# EasyEDA Pro project PRJ_Mainboard V0.1b.epro, board Mainboard_PCB
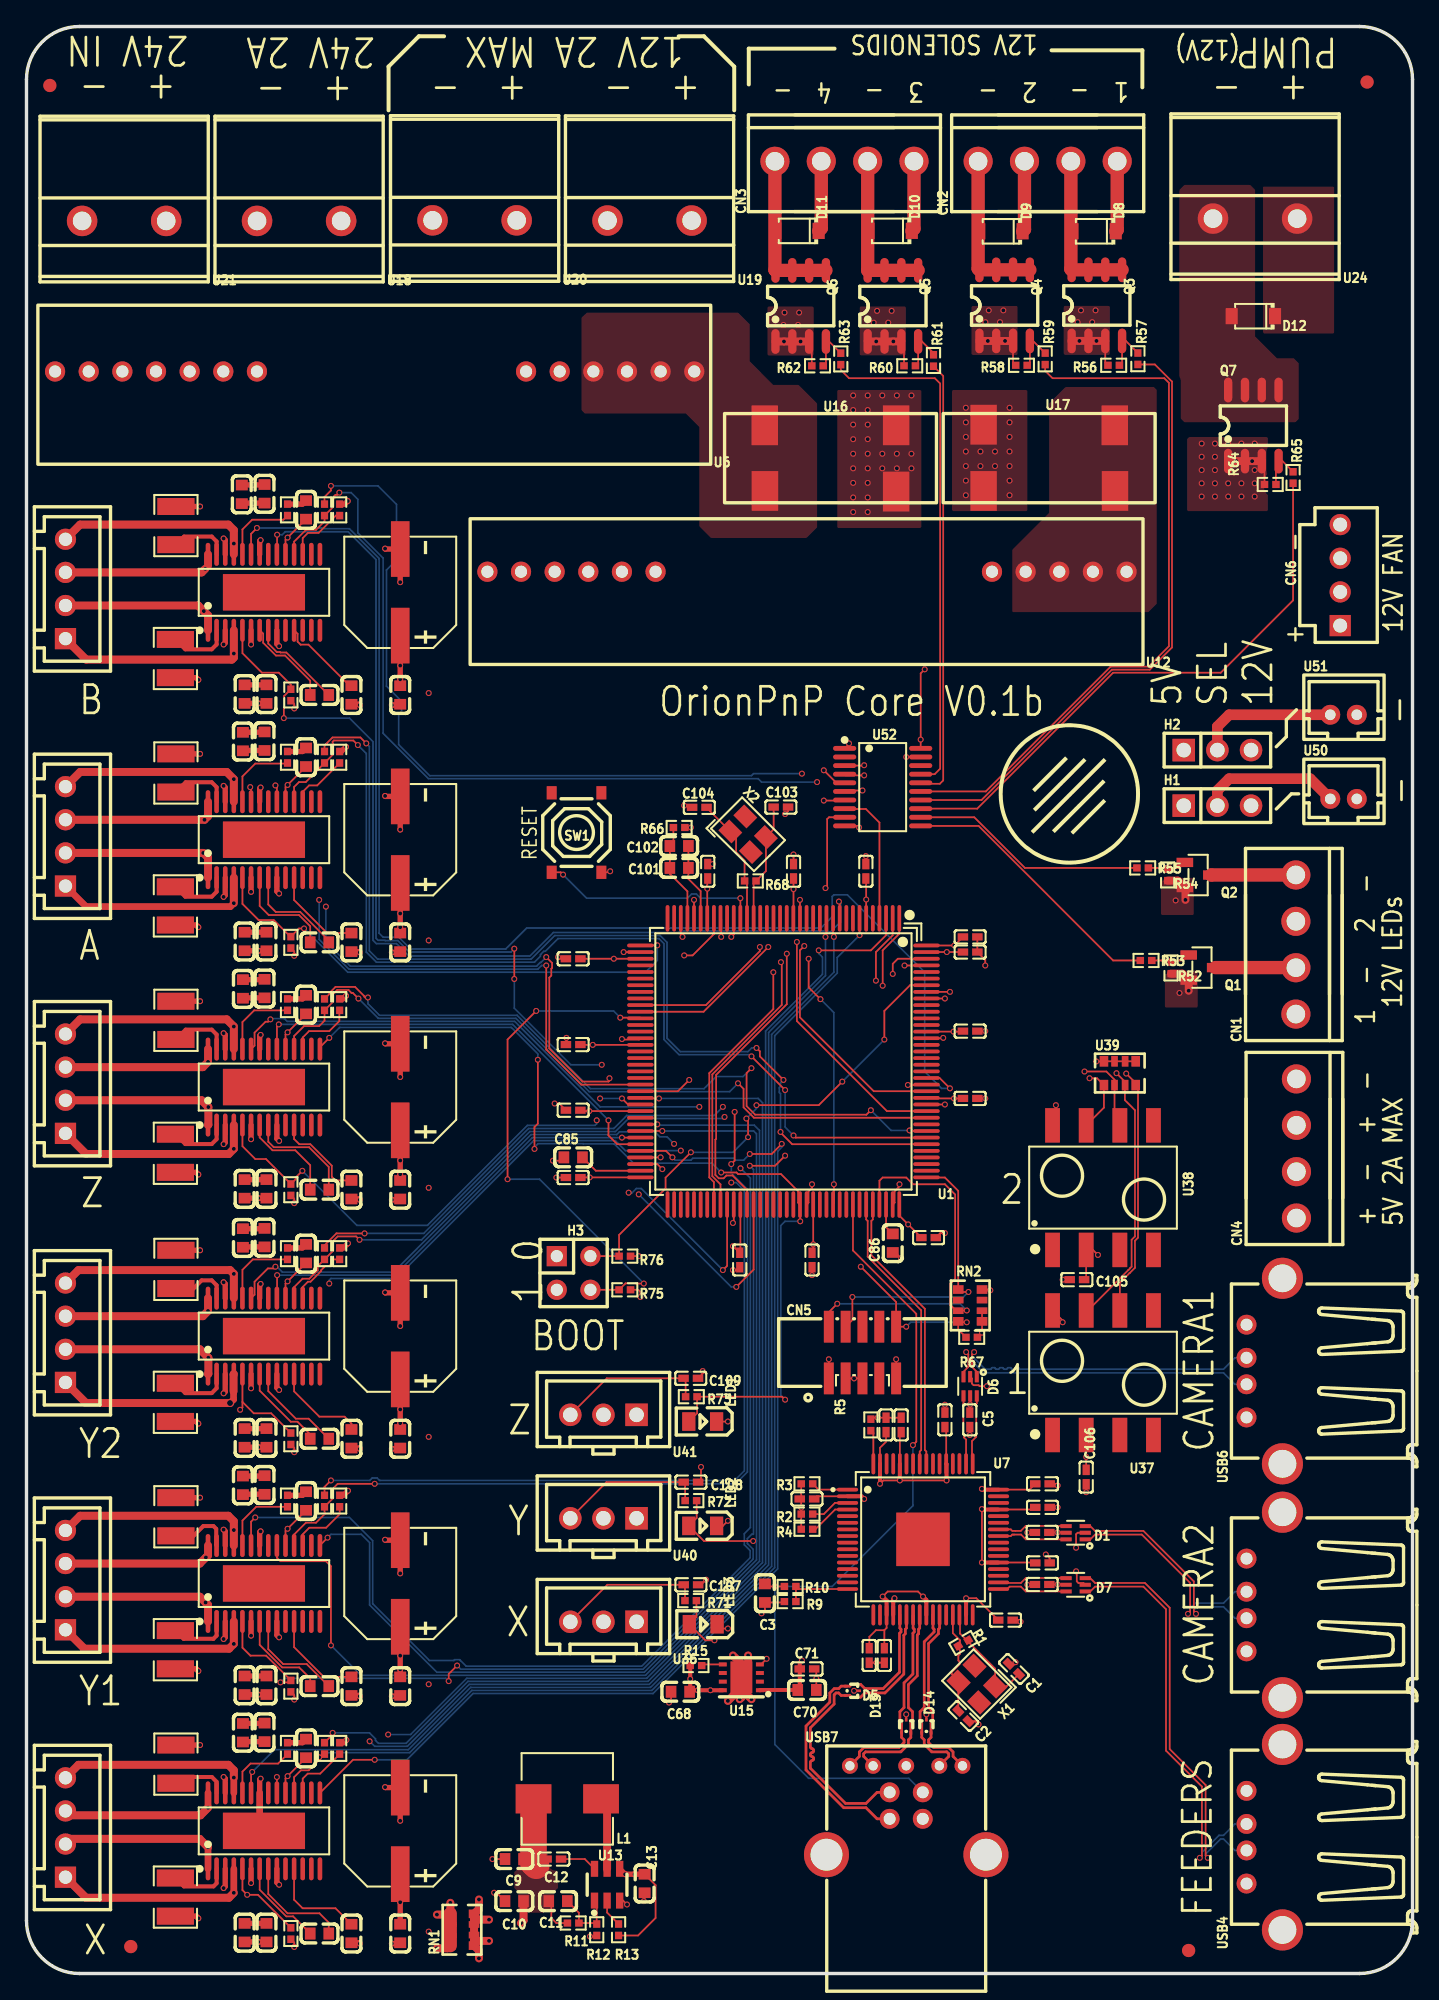
[diagram p6: board, top side]
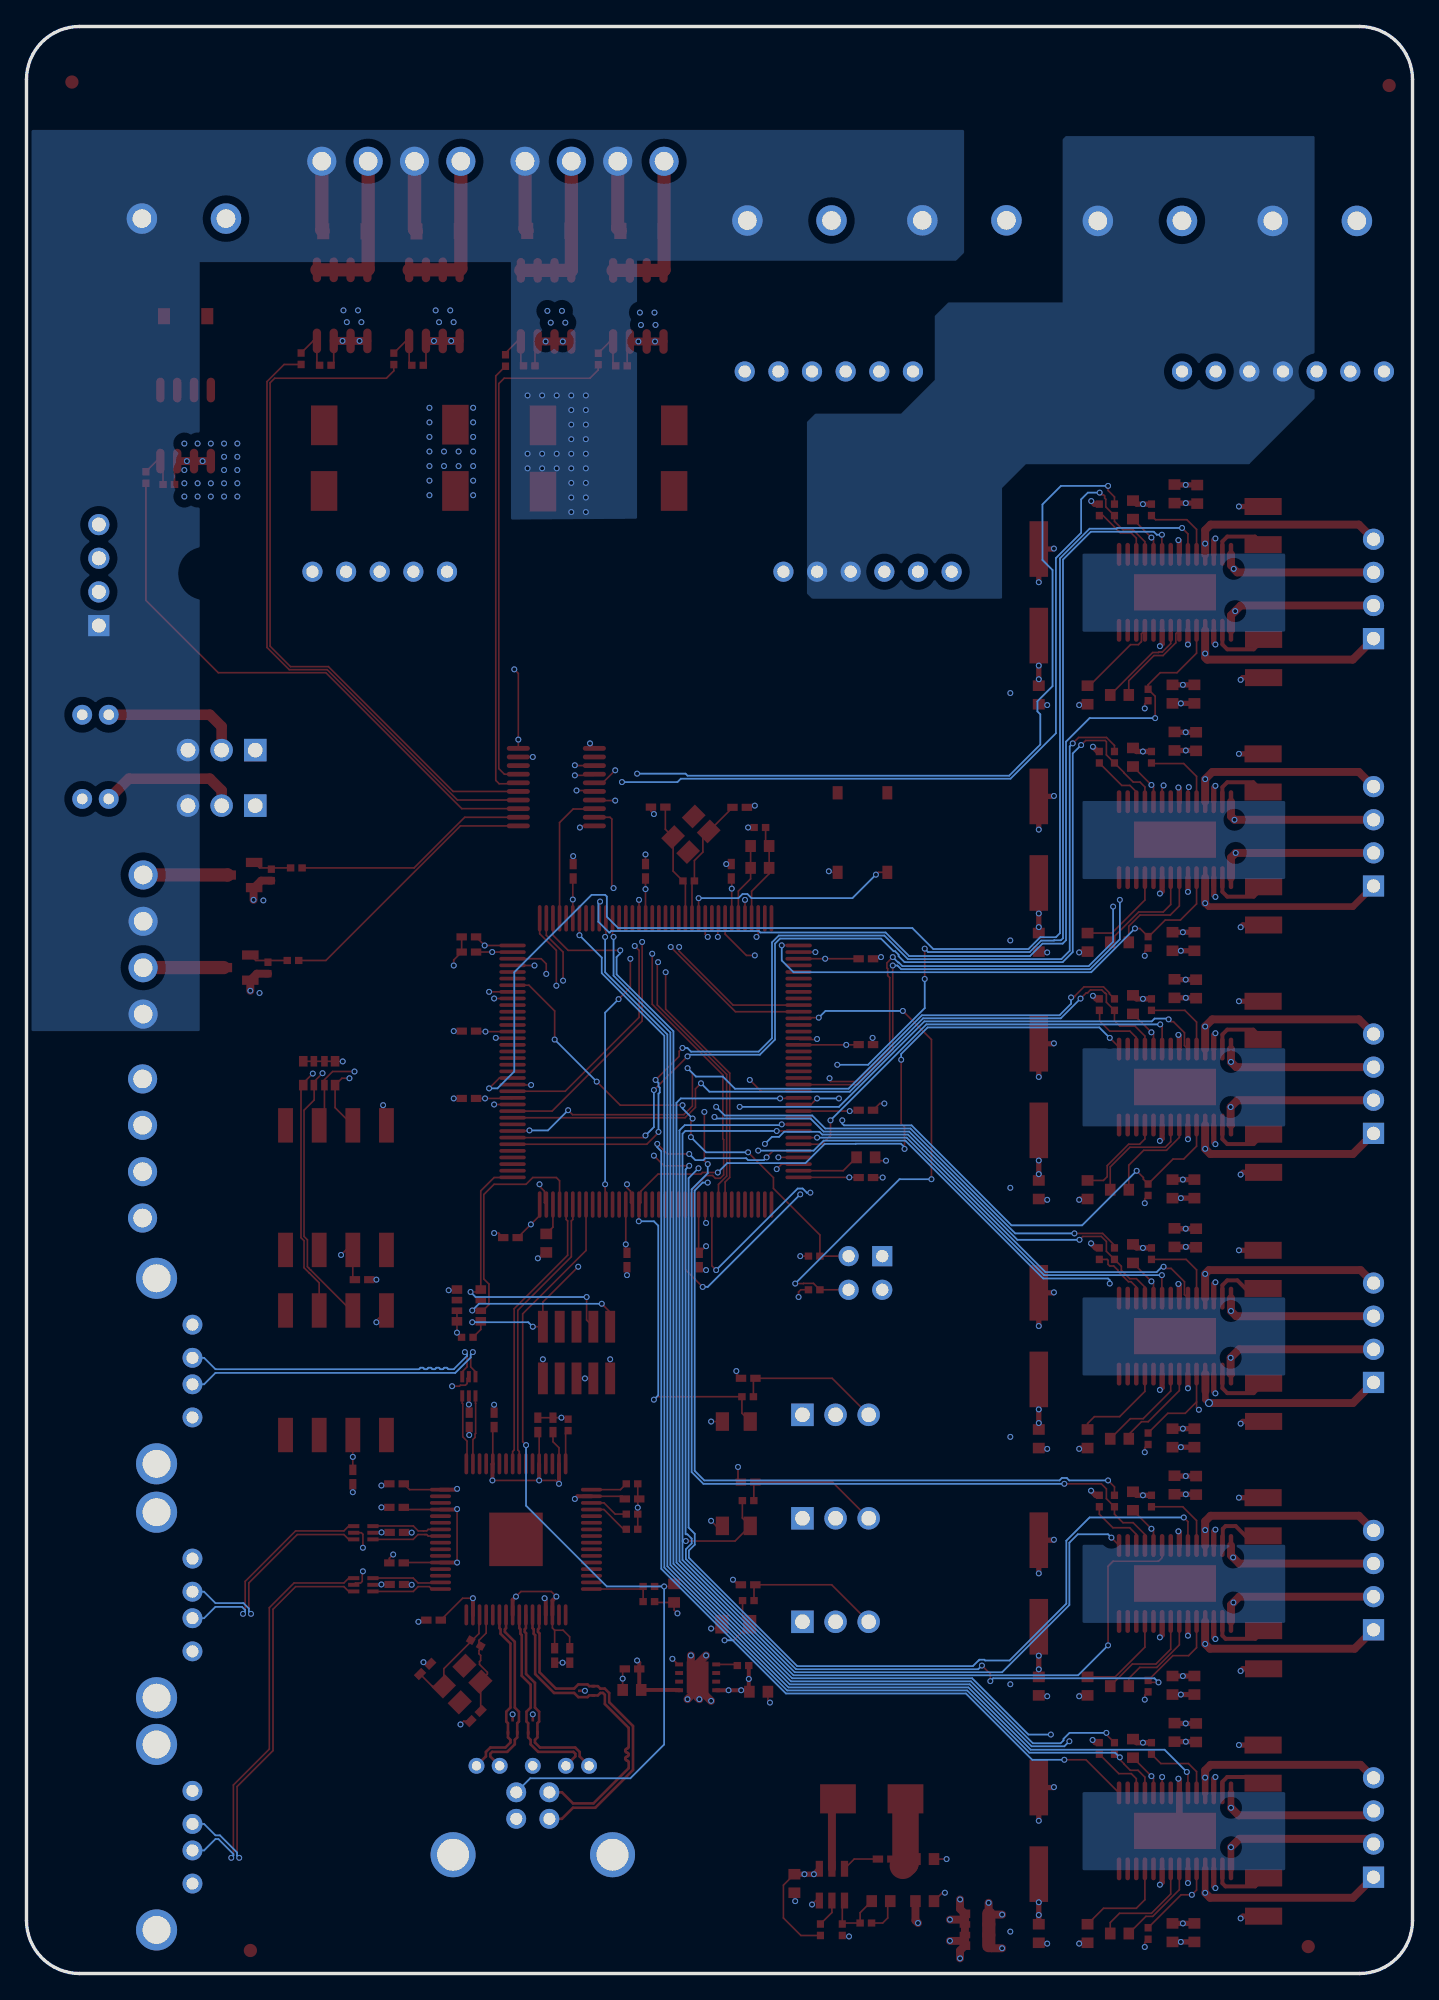
[diagram p7: board, bottom side, seen from below]

Outline 104.65 x 146.94 mm; copper layers: Top Layer, PWR, GND, Bottom Layer. Coordinates in mm from the lower left corner of the outline.
Outline path: 0,142.94 0,4 arc(1.17,1.17) 4,0 100.65,0 arc(103.48,1.17) 104.65,4 104.65,142.94 arc(103.48,145.77) 100.65,146.94 4,146.94 arc(1.17,145.77) 0,142.94
Stack: Top Layer 0.035mm Outer layer thickness 1oz / Dielectric1 0.2104mm 7628 RC49% 8.6mil / PWR 0.0152mm Inner layer thickness / Dielectric2 1.065mm 1.1mm H/HOZ Copper / GND 0.0152mm Inner layer thickness / Dielectric3 0.2104mm 7628 RC49% 8.6mil / Bottom Layer 0.035mm Outer layer thickness 1oz

## Design rules (mm)
net SSTX+: SSTX
net SSTX-: SSTX
net SSRX+: SSRX
net SSRX-: SSRX
net D1+: D1
net D1-: D1
net D2+: D2
net D2-: D2
net D3+: D3
net D3-: D3
net D4+: D4
net D4-: D4
net IN_D+: IN_D
net IN_D-: IN_D
net DCAM2-: DCAM2
net DCAM2+: DCAM2
net DCAM1-: DCAM1
net DCAM1+: DCAM1
net DSUB-: DSUB
net DSUB+: DSUB
net MOT1_B1: MOTOR
net MOT1_B2: MOTOR
net MOT1_A1: MOTOR
net MOT1_A2: MOTOR
net MOT2_B1: MOTOR
net MOT2_B2: MOTOR
net MOT2_A1: MOTOR
net MOT2_A2: MOTOR
net MOT3_B1: MOTOR
net MOT3_B2: MOTOR
net MOT3_A1: MOTOR
net MOT3_A2: MOTOR
net MOT4_B1: MOTOR
net MOT4_B2: MOTOR
net MOT4_A1: MOTOR
net MOT4_A2: MOTOR
net MOT5_B1: MOTOR
net MOT5_B2: MOTOR
net MOT5_A1: MOTOR
net MOT5_A2: MOTOR
net MOT6_B1: MOTOR
net MOT6_B2: MOTOR
net MOT6_A1: MOTOR
net MOT6_A2: MOTOR
template: Custom Config
spacing copperThickness1oz (default): track to track 0.102, other pairs 0.152 to 0.3
spacing copperThickness2oz: track to track 0.203, other pairs 0.152 to 0.3
track width copperThickness1oz (default): min 0.127, default 0.127, max 2.54
track width copperThickness2oz: min 0.203, default 0.254, max 2.54
track width MOTOR: min 0.127, default 0.5, max 2.54
track width 24V: min 0.127, default 0.4, max 2.54
differential pair USB_SS: width min 0.127, default 0.2, max 2.54; gap min 0.127, default 0.127
differential pair USB (default): width min 0.127, default 0.127, max 2.54; gap min 0.152, default 0.152
via viaSize (default): diameter min 0.4, default 0.45, max 10; hole min 0.3, default 0.3, max 6.3
via viaSize1: diameter min 0.45, default 0.45, max 10; hole min 0.3, default 0.3, max 6.3
via PWR: diameter min 0.4, default 0.6, max 10; hole min 0.3, default 0.45, max 6.3
net class MOTOR uses MOTOR, PWR
net 24V uses 24V, PWR
net SSTX+ uses USB_SS
net SSTX- uses USB_SS
net SSRX+ uses USB_SS
net SSRX- uses USB_SS
net IN_D+ uses USB_SS
net IN_D- uses USB_SS
net MOT1_B1 uses MOTOR, PWR
net MOT1_B2 uses MOTOR, PWR
net MOT1_A1 uses MOTOR, PWR
net MOT1_A2 uses MOTOR, PWR
net MOT2_B1 uses MOTOR, PWR
net MOT2_B2 uses MOTOR, PWR
net MOT2_A1 uses MOTOR, PWR
net MOT2_A2 uses MOTOR, PWR
net MOT3_B1 uses MOTOR, PWR
net MOT3_B2 uses MOTOR, PWR
net MOT3_A1 uses MOTOR, PWR
net MOT3_A2 uses MOTOR, PWR
net MOT4_B1 uses MOTOR, PWR
net MOT4_B2 uses MOTOR, PWR
net MOT4_A1 uses MOTOR, PWR
net MOT4_A2 uses MOTOR, PWR
net MOT5_B1 uses MOTOR, PWR
net MOT5_B2 uses MOTOR, PWR
net MOT5_A1 uses MOTOR, PWR
net MOT5_A2 uses MOTOR, PWR
net MOT6_B1 uses MOTOR, PWR
net MOT6_B2 uses MOTOR, PWR
net MOT6_A1 uses MOTOR, PWR
net MOT6_A2 uses MOTOR, PWR
diff pair SSTX uses USB_SS
diff pair SSRX uses USB_SS
diff pair IN_D uses USB_SS

## Placement (name value [footprint] x y rotation side)
C1  14pF  [C0402]  74.55 22.99 135 top
C2  14pF  [C0402]  70.74 19.43 315 top
C3  10uF  [C0603]  55.75 28.7 270 top
C4  100nF  [C0402]  76.68 33.29 180 top
C5  100nF  [C0402]  71.22 41.78 270 top
C8  100nF  [C0402]  76.68 29.36 180 top
C9  22u  [C0603]  36.83 8.64 180 top
C10  22u  [C0603]  36.83 5.46 180 top
C11  220p  [C0603]  40.13 5.46 0 top
C12  100nF  [C0402]  39.82 8.64 180 top
C13  10u  [C0603]  46.67 6.79 270 top
C14  22nF 50V  [C0603]  22.12 3.02 0 top
C15  100nF 50V  [C0603]  17.97 18.2 90 top
C16  100nF 50V  [C0603]  18.12 3.08 270 top
C17  100nF 50V  [C0603]  16.34 18.17 90 top
C18  100uF  [CAP-SMD_BD8.0-L8.3-W8.3-FD]  28.22 10.76 90 top
C19  100nF  [C0603]  21.11 16.99 90 top
C20  2u2 6.3V  [C0603]  24.53 3.02 270 top
C21  22nF 50V  [C0603]  22.12 21.69 0 top
C22  100nF 50V  [C0603]  17.97 36.87 90 top
C23  100nF 50V  [C0603]  18.12 21.75 270 top
C24  100nF 50V  [C0603]  16.34 36.84 90 top
C25  100uF  [CAP-SMD_BD8.0-L8.3-W8.3-FD]  28.22 29.43 90 top
C26  100nF  [C0603]  21.11 35.66 90 top
C27  2u2 6.3V  [C0603]  24.53 21.69 270 top
C28  22nF 50V  [C0603]  22.12 40.36 0 top
C29  100nF 50V  [C0603]  17.97 55.54 90 top
C30  100nF 50V  [C0603]  18.12 40.42 270 top
C31  100nF 50V  [C0603]  16.34 55.51 90 top
C32  100uF  [CAP-SMD_BD8.0-L8.3-W8.3-FD]  28.22 48.1 90 top
C33  100nF  [C0603]  21.11 54.33 90 top
C34  2u2 6.3V  [C0603]  24.53 40.36 270 top
C35  22nF 50V  [C0603]  22.12 59.15 0 top
C36  100nF 50V  [C0603]  17.97 74.33 90 top
C37  100nF 50V  [C0603]  18.12 59.22 270 top
C38  100nF 50V  [C0603]  16.34 74.31 90 top
C39  100uF  [CAP-SMD_BD8.0-L8.3-W8.3-FD]  28.22 66.9 90 top
C40  100nF  [C0603]  21.11 73.12 90 top
C41  2u2 6.3V  [C0603]  24.53 59.15 270 top
C42  22nF 50V  [C0603]  22.12 77.82 0 top
C43  100nF 50V  [C0603]  17.97 93 90 top
C44  100nF 50V  [C0603]  18.12 77.88 270 top
C45  100nF 50V  [C0603]  16.34 92.97 90 top
C46  100uF  [CAP-SMD_BD8.0-L8.3-W8.3-FD]  28.22 85.57 90 top
C47  100nF  [C0603]  21.11 91.79 90 top
C48  2u2 6.3V  [C0603]  24.53 77.82 270 top
C49  22nF 50V  [C0603]  22.12 96.49 0 top
C50  100nF 50V  [C0603]  16.26 111.63 90 top
C51  100nF 50V  [C0603]  18.12 96.55 270 top
C52  100nF 50V  [C0603]  17.97 111.67 90 top
C53  100uF  [CAP-SMD_BD8.0-L8.3-W8.3-FD]  28.22 104.24 90 top
C54  100nF  [C0603]  21.11 110.46 90 top
C55  2u2 6.3V  [C0603]  24.53 96.49 270 top
C56  4u7 35v  [C0603]  16.47 3.08 270 top
C57  4u7 35v  [C0603]  28.22 3.02 270 top
C58  4u7 35v  [C0603]  16.47 21.75 270 top
C59  4u7 35v  [C0603]  28.22 21.69 270 top
C60  4u7 35v  [C0603]  16.47 40.42 270 top
C61  4u7 35v  [C0603]  28.22 40.36 270 top
C62  4u7 35v  [C0603]  16.47 96.55 270 top
C63  4u7 35v  [C0603]  28.22 96.49 270 top
C64  4u7 35v  [C0603]  16.47 77.88 270 top
C65  4u7 35v  [C0603]  28.22 77.82 270 top
C66  4u7 35v  [C0603]  16.47 59.22 270 top
C67  4u7 35v  [C0603]  28.22 59.15 270 top
C68  22u  [C0603]  49.37 21.26 180 top
C70  10u  [C0603]  58.93 21.4 0 top
C71  100nF  [C0402]  58.93 22.99 0 top
C75  100nF  [C0402]  58.93 35.81 180 top
C76  100nF  [C0402]  73.91 26.67 0 top
C77  100nF  [C0402]  76.71 36.96 0 top
C78  100nF  [C0402]  66.04 41.4 90 top
C79  100nF  [C0402]  64.9 41.4 90 top
C80  100nF  [C0402]  64.77 24 270 top
C81  100nF  [C0402]  69.34 41.78 90 top
C82  100nF  [C0402]  63.63 24 270 top
C83  100nF  [C0402]  76.71 30.99 0 top
C84  100nF  [C0402]  76.71 35.18 0 top
C85  2u2 6.3V  [C0603]  41.28 61.59 0 top
C86  2u2 6.3V  [C0603]  65.41 55.12 90 top
C87  100nF  [C0402]  71.25 78.23 180 top
C88  100nF  [C0402]  71.25 77.09 180 top
C89  100nF  [C0402]  63.37 83.19 270 top
C90  100nF  [C0402]  41.28 65.15 0 top
C91  100nF  [C0402]  53.85 53.85 90 top
C92  100nF  [C0402]  59.31 53.85 90 top
C93  100nF  [C0402]  71.25 66.04 180 top
C94  100nF  [C0402]  57.91 83.19 270 top
C95  100nF  [C0402]  51.44 83.19 270 top
C96  100nF  [C0402]  41.28 76.58 0 top
C97  100nF  [C0402]  41.28 70.1 0 top
C98  100nF  [C0402]  41.28 60.07 0 top
C99  100nF  [C0402]  68.11 55.54 180 top
C100  100nF  [C0402]  71.25 71.12 180 top
C101  10u  [C0603]  49.28 83.44 180 top
C102  100nF  [C0603]  49.28 85.09 0 top
C103  14pF  [C0402]  56.96 88.03 0 top
C104  14pF  [C0402]  50.8 88.01 180 top
C105  100nF  [C0402]  79.31 52.36 180 top
C106  100nF  [C0402]  80.01 37.47 270 top
C107  100nF  [C0402]  50.16 29.34 180 top
C108  100nF  [C0402]  50.16 37.08 180 top
C109  100nF  [C0402]  50.16 44.92 180 top
CN1  1751264  [CONN-TH_MKDS1-4-3.5]  95.84 77.66 90 top
CN2  1751264  [CONN-TH_MKDS1-4-3.5]  77.1 136.77 180 top
CN3  1751264  [CONN-TH_MKDS1-4-3.5]  61.76 136.77 180 top
CN4  1751264  [CONN-TH_MKDS1-4-3.5]  95.88 62.26 90 top
CN5  20021521-00010T1LF  [IDC-SMD_10P-P1.27_X1270WVS-2X05B-6TV01]  63.12 46.86 0 top
CN6  2510-4A  [CONN-TH_4P-P2.54_CAX_2510-4A]  99.19 105.54 90 top
D1  USBLC6-2P6  [SOT-666-6_L1.6-W1.2-P0.50-LS1.6-BR]  79.21 33.26 0 top
D5  TPD2EUSB30DRTR  [SOT-9X3-3_L1.0-W0.8-P0.35-LS1.0-BR]  62.36 21.34 180 top
D6  USBLC6-2P6  [SOT-666-6_L1.6-W1.2-P0.50-LS1.6-BR]  71.25 44.31 90 top
D7  USBLC6-2P6  [SOT-666-6_L1.6-W1.2-P0.50-LS1.6-BR]  79.21 29.34 0 top
D8  1N5819HW-7-F  [SOD-123_L2.7-W1.6-LS3.7-RD]  80.61 131.49 180 top
D9  1N5819HW-7-F  [SOD-123_L2.7-W1.6-LS3.7-RD]  73.57 131.48 180 top
D10  1N5819HW-7-F  [SOD-123_L2.7-W1.6-LS3.7-RD]  65.21 131.52 180 top
D11  1N5819HW-7-F  [SOD-123_L2.7-W1.6-LS3.7-RD]  58.17 131.51 180 top
D12  1N5819HW-7-F  [SOD-123_L2.7-W1.6-LS3.7-RD]  92.63 125.08 180 top
D13  TPD2EUSB30DRTR  [SOT-9X3-3_L1.0-W0.8-P0.35-LS1.0-BR]  66.42 18.67 270 top
D14  TPD2EUSB30DRTR  [SOT-9X3-3_L1.0-W0.8-P0.35-LS1.0-BR]  67.94 18.67 270 top
H1  -  [HDR-TH_3P-P2.54-V-M]  89.92 88.14 0 top
H2  -  [HDR-TH_3P-P2.54-V-M]  89.92 92.33 0 top
H3  -  [HDR-TH_4P-P2.54-V-M-R2-C2-S2.54-1]  41.31 52.87 270 top
L1  3.3uH  [IND-SMD_L6.9-W6.9-LS7.0]  40.83 13.18 180 top
LED1  NCD0805R1  [LED0805-R-RD]  51.05 41.66 180 top
LED2  NCD0805R1  [LED0805-R-RD]  51.05 33.78 180 top
LED3  NCD0805R1  [LED0805-R-RD]  51.09 26.36 180 top
Q1  AO3400A  [SOT-23-3_L2.9-W1.3-P1.90-LS2.4-BR]  88.75 75.92 180 top
Q2  AO3400A  [SOT-23-3_L2.9-W1.3-P1.90-LS2.4-BR]  88.46 82.9 180 top
Q3  4406  [SOP-8_L4.9-W3.9-P1.27-LS6.0-BL]  80.81 125.89 0 top
Q4  4406  [SOP-8_L4.9-W3.9-P1.27-LS6.0-BL]  73.85 125.89 0 top
Q5  4406  [SOP-8_L4.9-W3.9-P1.27-LS6.0-BL]  65.42 125.85 0 top
Q6  4406  [SOP-8_L4.9-W3.9-P1.27-LS6.0-BL]  58.45 125.85 0 top
Q7  4406  [SOP-8_L4.9-W3.9-P1.27-LS6.0-BL]  92.63 116.82 0 top
R1  1M  [R0402]  70.73 24.94 210 top
R2  10K  [R0402]  58.93 34.67 0 top
R3  10K  [R0402]  58.93 36.96 0 top
R4  10K  [R0402]  58.93 33.53 0 top
R5  10K  [R0402]  63.75 41.4 270 top
R9  10K 1%  [R0402]  57.66 28.07 180 top
R10  90k9 1%  [R0402]  57.66 29.21 0 top
R11  100k  [R0402]  41.28 3.81 180 top
R12  22k1  [R0402]  43.05 3.3 90 top
R13  10k  [R0402]  44.7 3.3 270 top
R15  10k  [R0402]  50.55 23.24 0 top
R16  0R120 1W  [R1210]  11.28 15.8 90 top
R17  0R120 1W  [R1210]  11.24 5.77 90 top
R18  10k  [R0402]  23.65 16.99 90 top
R19  1k  [R0402]  22.5 16.99 90 top
R20  10k  [R0402]  19.96 3.02 270 top
R21  100k  [R0402]  19.71 16.99 90 top
R22  0R120 1W  [R1210]  11.28 34.47 90 top
R23  0R120 1W  [R1210]  11.24 24.44 90 top
R24  10k  [R0402]  23.65 35.66 90 top
R25  1k  [R0402]  22.5 35.66 90 top
R26  10k  [R0402]  19.96 21.69 270 top
R27  100k  [R0402]  19.71 35.66 90 top
R28  0R120 1W  [R1210]  11.28 53.14 90 top
R29  0R120 1W  [R1210]  11.24 43.11 90 top
R30  10k  [R0402]  23.65 54.33 90 top
R31  1k  [R0402]  22.5 54.33 90 top
R32  10k  [R0402]  19.96 40.36 270 top
R33  100k  [R0402]  19.71 54.33 90 top
R34  0R120 1W  [R1210]  11.28 71.94 90 top
R35  0R120 1W  [R1210]  11.24 61.9 90 top
R36  10k  [R0402]  23.65 73.12 90 top
R37  1k  [R0402]  22.5 73.12 90 top
R38  10k  [R0402]  19.96 59.15 270 top
R39  100k  [R0402]  19.71 73.12 90 top
R40  0R120 1W  [R1210]  11.28 90.6 90 top
R41  0R120 1W  [R1210]  11.24 80.57 90 top
R42  10k  [R0402]  23.65 91.79 90 top
R43  1k  [R0402]  22.5 91.79 90 top
R44  10k  [R0402]  19.96 77.82 270 top
R45  100k  [R0402]  19.71 91.79 90 top
R46  0R120 1W  [R1210]  11.28 109.27 90 top
R47  0R120 1W  [R1210]  11.24 99.24 90 top
R48  10k  [R0402]  23.65 110.46 90 top
R49  1k  [R0402]  22.5 110.46 90 top
R50  10k  [R0402]  19.96 96.49 270 top
R51  100k  [R0402]  19.71 110.46 90 top
R52  10K  [R0402]  86.42 75.89 90 top
R53  100  [R0402]  84.53 76.45 180 top
R54  10K  [R0402]  86.16 82.91 90 top
R55  100  [R0402]  84.27 83.44 180 top
R56  10K  [R0402]  82.09 121.37 0 top
R57  100  [R0402]  83.91 121.87 270 top
R58  10K  [R0402]  75.12 121.37 0 top
R59  100  [R0402]  76.91 121.86 270 top
R60  10K  [R0402]  66.69 121.33 0 top
R61  100  [R0402]  68.48 121.73 270 top
R62  10K  [R0402]  59.72 121.33 0 top
R63  100  [R0402]  61.48 121.85 270 top
R64  10K  [R0402]  93.9 112.38 0 top
R65  100  [R0402]  95.63 112.9 270 top
R66  10R  [R0402]  49.28 86.49 180 top
R67  10K  [R0402]  71.37 48.02 0 top
R68  1M  [R0402]  54.65 82.45 180 top
R71  1k  [R0402]  50.15 28.14 0 top
R72  1k  [R0402]  50.16 35.69 0 top
R73  1k  [R0402]  50.2 43.53 0 top
R75  1M  [R0402]  45.18 51.6 180 top
R76  1M  [R0402]  45.18 54.14 180 top
RN1  0Ω  [RES-ARRAY-SMD_0603-8P-L3.2-W1.6-BL]  32.89 3.3 90 top
RN2  10kΩ  [RES-ARRAY-SMD_0603-8P-L3.2-W1.6-BL]  71.25 50.42 270 top
SW1  TS-1187A-B-A-B  [SW-SMD_4P-L5.1-W5.1-P3.70-LS6.5-TL_H1.5]  41.53 86.11 90 top
U1  STM32F407ZGT6  [LQFP-144_L20.0-W20.0-P0.50-LS22.0-BL]  57.15 68.83 180 top
U2  TMC2226-SA-T  [HTSSOP-28_L9.8-W4.5-P0.65-LS6.6-BL-EP]  17.93 10.76 0 top
U6  NID100-12  [NID100-v PSU module]  50.42 120.9 180 top
U7  TUSB8041IPAPRQ1  [TQFP-64_L10.0-W10.0-P0.50-LS12.0-BL-EP]  67.69 32.77 270 top
U12  NID35-5  [NID35-v PSU module]  83.06 105.79 180 top
U13  SY8156IADC  [TSOT-23-6_L2.9-W1.6-P0.95-LS2.8-BL]  43.84 6.7 0 top
U15  TPS74611PQWDRBRQ1  [SON-8_L3.0-W3.0-P0.65-TL-EP]  53.97 22.35 180 top
U16  -  [XF-508PVS-B-B-R]  65.66 116.84 180 top
U17  -  [XF-508PVS-B-B-R]  72.26 111.89 0 top
U18  1714955  [CONN-TH_P6.35_1714955]  20.58 132.27 180 top
U19  1714955  [CONN-TH_P6.35_1714955]  47.04 132.3 180 top
U20  1714955  [CONN-TH_P6.35_1714955]  33.83 132.31 180 top
U21  1714955  [CONN-TH_P6.35_1714955]  7.37 132.27 180 top
U24  1714955  [CONN-TH_P6.35_1714955]  92.76 132.44 180 top
U25  TMC2226-SA-T  [HTSSOP-28_L9.8-W4.5-P0.65-LS6.6-BL-EP]  17.93 29.43 0 top
U26  TMC2226-SA-T  [HTSSOP-28_L9.8-W4.5-P0.65-LS6.6-BL-EP]  17.93 48.1 0 top
U27  TMC2226-SA-T  [HTSSOP-28_L9.8-W4.5-P0.65-LS6.6-BL-EP]  17.93 66.9 0 top
U28  TMC2226-SA-T  [HTSSOP-28_L9.8-W4.5-P0.65-LS6.6-BL-EP]  17.93 85.57 0 top
U29  TMC2226-SA-T  [HTSSOP-28_L9.8-W4.5-P0.65-LS6.6-BL-EP]  17.93 104.24 0 top
U30  B4B-XH-A-BK(LF)(SN)  [CONN-TH_B4B-XH-A-BK-LF-SN]  2.94 11.02 90 top
U31  B4B-XH-A-BK(LF)(SN)  [CONN-TH_B4B-XH-A-BK-LF-SN]  2.94 29.69 90 top
U32  B4B-XH-A-BK(LF)(SN)  [CONN-TH_B4B-XH-A-BK-LF-SN]  2.94 48.36 90 top
U33  B4B-XH-A-BK(LF)(SN)  [CONN-TH_B4B-XH-A-BK-LF-SN]  2.94 67.15 90 top
U34  B4B-XH-A-BK(LF)(SN)  [CONN-TH_B4B-XH-A-BK-LF-SN]  2.94 85.82 90 top
U35  B4B-XH-A-BK(LF)(SN)  [CONN-TH_B4B-XH-A-BK-LF-SN]  2.94 104.49 90 top
U36  XY-XHB2.54-3A11  [HDR-TH_3P-P2.50-V-F-2]  43.56 26.54 180 top
U37  GZP6897D2.5KPW  [SMD-8_L11.0-W7.0-P2.54-LS10.4-BL]  81.28 45.34 0 top
U38  GZP6897D2.5KPW  [SMD-8_L11.0-W7.0-P2.54-LS10.4-BL]  81.28 59.31 0 top
U39  4.7kΩ  [RES-ARRAY-SMD_0603-8P-L3.2-W1.6-BL]  82.55 67.94 0 top
U40  XY-XHB2.54-3A11  [HDR-TH_3P-P2.50-V-F-2]  43.56 34.35 180 top
U41  XY-XHB2.54-3A11  [HDR-TH_3P-P2.50-V-F-2]  43.56 42.16 180 top
U46  FIDUCIAL  [FIDUCIAL_1MM]  7.87 2.03 0 top
U47  FIDUCIAL  [FIDUCIAL_1MM]  87.74 1.74 0 top
U48  FIDUCIAL  [FIDUCIAL_1MM]  101.22 142.75 0 top
U49  FIDUCIAL  [FIDUCIAL_1MM]  1.76 142.49 0 top
U50  WAFER-PH2.0-2PZZ  [CONN-TH_2P-P2.00_HC-PH-2A-M]  99.44 88.65 0 top
U51  WAFER-PH2.0-2PZZ  [CONN-TH_2P-P2.00_HC-PH-2A-M]  99.44 95 0 top
U52  74HCT245PW,118  [TSSOP-20_L6.5-W4.4-P0.65-LS6.4-BL]  64.64 89.53 270 top
USB4  902-131A1011D10100  [USB-A-TH__USB-AF-90]  93.47 10.29 90 top
USB5  902-131A1011D10100  [USB-A-TH__USB-AF-90]  93.47 27.81 90 top
USB6  902-131A1011D10100  [USB-A-TH__USB-AF-90]  93.47 45.47 90 top
USB7  USB-306BWD-ARW  [USB-B-TH_XUNPU_USB-306BWD-ARW]  66.42 12.32 0 top
X1  24MHz  [CRYSTAL-SMD_4P-L3.2-W2.5-BL]  71.75 21.84 135 top
X2  8MHz  [CRYSTAL-SMD_4P-L3.2-W2.5-BL-2]  54.48 85.98 315 top

## Footprints (pads in the part's own frame, mm; a bottom-side part is the same pattern mirrored in y, then rotated)
C0402
  rect 0.79x0.54 smd: 1(-0.545,0) 2(0.545,0)
C0603
  rect 0.8x0.9 smd: 1(-0.7,0) 2(0.7,0)
CAP-SMD_BD8.0-L8.3-W8.3-FD
  rect 4.2x1.4 smd: 1(-3.267,0) 2(3.267,0)
CONN-TH_2P-P2.00_HC-PH-2A-M
  round 1.5 hole 0.8: 1(-1,0) 2(1,0)
CONN-TH_4P-P2.54_CAX_2510-4A
  rect 1.6x1.6 hole 1.05: 1(-3.81,0)
  round 1.6 hole 1.05: 2(-1.27,0) 3(1.27,0) 4(3.81,0)
CONN-TH_B4B-XH-A-BK-LF-SN
  rect 1.6x1.6 hole 1: 1(-3.75,0)
  round 1.6 hole 1: 2(-1.25,0) 3(1.25,0) 4(3.75,0)
CONN-TH_MKDS1-4-3.5
  round 2.2 hole 1.4: 1(-5.25,-0.002) 2(-1.75,-0.002) 3(1.75,-0.002) 4(5.25,0.002)
CONN-TH_P6.35_1714955
  round 2.3 hole 1.4: 1(-3.175,0) 2(3.175,0)
CRYSTAL-SMD_4P-L3.2-W2.5-BL
  rect 1.4x1.2 smd: 1(-1.1,-0.85) 2(1.1,-0.85) 3(1.1,0.85) 4(-1.1,0.85)
CRYSTAL-SMD_4P-L3.2-W2.5-BL-2
  rect 1.4x1.15 smd: 1(-1.1,-0.8) 2(1.1,-0.8) 3(1.1,0.8) 4(-1.1,0.8)
FIDUCIAL_1MM
  round 1 smd: 1(0,0)
HDR-TH_3P-P2.50-V-F-2
  rect 1.7x1.7 hole 1.1: 1(-2.5,0)
  round 1.7 hole 1.1: 2(0,0) 3(2.5,0)
HDR-TH_3P-P2.54-V-M
  rect 1.7x1.7 hole 1.1: 1(-2.54,0)
  round 1.7 hole 1.1: 2(0,0) 3(2.54,0)
HDR-TH_4P-P2.54-V-M-R2-C2-S2.54-1
  rect 1.524x1.524 hole 0.914: 1(-1.27,-1.27)
  round 1.524 hole 0.914: 2(-1.27,1.27) 3(1.27,-1.27) 4(1.27,1.27)
HTSSOP-28_L9.8-W4.5-P0.65-LS6.6-BL-EP
  oval 0.343x1.732 smd: 1(-4.225,-2.866) 2(-3.575,-2.866) 3(-2.925,-2.866) 4(-2.275,-2.866) 5(-1.625,-2.866) 6(-0.975,-2.866) 7(-0.325,-2.866) 8(0.325,-2.866) 9(0.975,-2.866) 10(1.625,-2.866) 11(2.275,-2.866) 12(2.925,-2.866) 13(3.575,-2.866) 14(4.225,-2.866) 15(4.225,2.866) 16(3.575,2.866) 17(2.925,2.866) 18(2.275,2.866) 19(1.625,2.866) 20(0.975,2.866) 21(0.325,2.866) 22(-0.325,2.866) 23(-0.975,2.866) 24(-1.625,2.866) 25(-2.275,2.866) 26(-2.925,2.866) 27(-3.575,2.866) 28(-4.225,2.866)
  rect 6.2x2.75 smd: 29(0,0)
IDC-SMD_10P-P1.27_X1270WVS-2X05B-6TV01
  rect 0.75x2.4 smd: 1(-2.54,-1.95) 2(-2.54,1.95) 3(-1.27,-1.95) 4(-1.27,1.95) 5(0,-1.95) 6(0,1.95) 7(1.27,-1.95) 8(1.27,1.95) 9(2.54,-1.95) 10(2.54,1.95)
IND-SMD_L6.9-W6.9-LS7.0
  rect 2.7x2.2 smd: 1(-2.55,0) 2(2.55,0)
LED0805-R-RD
  rect 1x1.399 smd: 1(1.05,0) 2(-1.05,0)
LQFP-144_L20.0-W20.0-P0.50-LS22.0-BL
  oval 0.28x2 smd: 1(-8.75,-10.8) 2(-8.25,-10.8) 3(-7.75,-10.8) 4(-7.25,-10.8) 5(-6.75,-10.8) 6(-6.25,-10.8) 7(-5.75,-10.8) 8(-5.25,-10.8) 9(-4.75,-10.8) 10(-4.25,-10.8) 11(-3.75,-10.8) 12(-3.25,-10.8) 13(-2.75,-10.8) 14(-2.25,-10.8) 15(-1.75,-10.8) 16(-1.25,-10.8) 17(-0.75,-10.8) 18(-0.25,-10.8) 19(0.25,-10.8) 20(0.75,-10.8) 21(1.25,-10.8) 22(1.75,-10.8) 23(2.25,-10.8) 24(2.75,-10.8) 25(3.25,-10.8) 26(3.75,-10.8) 27(4.25,-10.8) 28(4.75,-10.8) 29(5.25,-10.8) 30(5.75,-10.8) 31(6.25,-10.8) 32(6.75,-10.8) 33(7.25,-10.8) 34(7.75,-10.8) 35(8.25,-10.8) 36(8.75,-10.8) 73(8.75,10.8) 74(8.25,10.8) 75(7.75,10.8) 76(7.25,10.8) 77(6.75,10.8) 78(6.25,10.8) 79(5.75,10.8) 80(5.25,10.8) 81(4.75,10.8) 82(4.25,10.8) 83(3.75,10.8) 84(3.25,10.8) 85(2.75,10.8) 86(2.25,10.8) 87(1.75,10.8) 88(1.25,10.8) 89(0.75,10.8) 90(0.25,10.8) 91(-0.25,10.8) 92(-0.75,10.8) 93(-1.25,10.8) 94(-1.75,10.8) 95(-2.25,10.8) 96(-2.75,10.8) 97(-3.25,10.8) 98(-3.75,10.8) 99(-4.25,10.8) 100(-4.75,10.8) 101(-5.25,10.8) 102(-5.75,10.8) 103(-6.25,10.8) 104(-6.75,10.8) 105(-7.25,10.8) 106(-7.75,10.8) 107(-8.25,10.8) 108(-8.75,10.8)
  oval 2x0.28 smd: 37(10.8,-8.75) 38(10.8,-8.25) 39(10.8,-7.75) 40(10.8,-7.25) 41(10.8,-6.75) 42(10.8,-6.25) 43(10.8,-5.75) 44(10.8,-5.25) 45(10.8,-4.75) 46(10.8,-4.25) 47(10.8,-3.75) 48(10.8,-3.25) 49(10.8,-2.75) 50(10.8,-2.25) 51(10.8,-1.75) 52(10.8,-1.25) 53(10.8,-0.75) 54(10.8,-0.25) 55(10.8,0.25) 56(10.8,0.75) 57(10.8,1.25) 58(10.8,1.75) 59(10.8,2.25) 60(10.8,2.75) 61(10.8,3.25) 62(10.8,3.75) 63(10.8,4.25) 64(10.8,4.75) 65(10.8,5.25) 66(10.8,5.75) 67(10.8,6.25) 68(10.8,6.75) 69(10.8,7.25) 70(10.8,7.75) 71(10.8,8.25) 72(10.8,8.75) 109(-10.8,8.75) 110(-10.8,8.25) 111(-10.8,7.75) 112(-10.8,7.25) 113(-10.8,6.75) 114(-10.8,6.25) 115(-10.8,5.75) 116(-10.8,5.25) 117(-10.8,4.75) 118(-10.8,4.25) 119(-10.8,3.75) 120(-10.8,3.25) 121(-10.8,2.75) 122(-10.8,2.25) 123(-10.8,1.75) 124(-10.8,1.25) 125(-10.8,0.75) 126(-10.8,0.25) 127(-10.8,-0.25) 128(-10.8,-0.75) 129(-10.8,-1.25) 130(-10.8,-1.75) 131(-10.8,-2.25) 132(-10.8,-2.75) 133(-10.8,-3.25) 134(-10.8,-3.75) 135(-10.8,-4.25) 136(-10.8,-4.75) 137(-10.8,-5.25) 138(-10.8,-5.75) 139(-10.8,-6.25) 140(-10.8,-6.75) 141(-10.8,-7.25) 142(-10.8,-7.75) 143(-10.8,-8.25) 144(-10.8,-8.75)
NID35-v PSU module
  round 1.524 hole 0.914: 1(0,0) 2(2.54,0) 3(5.08,0) 4(7.62,0) 5(10.16,0) 6(35.56,0) 7(38.1,0) 8(40.64,0) 9(43.18,0) 10(45.72,0) 11(48.26,0)
NID100-v PSU module
  round 1.524 hole 0.914: 1(0,0) 2(2.54,0) 3(5.08,0) 4(7.62,0) 5(10.16,0) 6(12.7,0) 7(33.02,0) 8(35.56,0) 9(38.1,0) 10(40.64,0) 11(43.18,0) 12(45.72,0) 13(48.26,0)
R0402
  rect 0.566x0.54 smd: 1(-0.433,0) 2(0.433,0)
R1210
  rect 1.282x2.808 smd: 1(-1.441,0) 2(1.441,0)
RES-ARRAY-SMD_0603-8P-L3.2-W1.6-BL
  rect 0.65x0.8 smd: 1(-1.2,-0.9) 4(1.2,-0.9) 5(1.2,0.9) 8(-1.2,0.9)
  rect 0.5x0.8 smd: 2(-0.4,-0.9) 3(0.4,-0.9) 6(0.4,0.9) 7(-0.4,0.9)
SMD-8_L11.0-W7.0-P2.54-LS10.4-BL
  rect 1.12x2.6 smd: 1(-3.81,-4.7) 2(-1.27,-4.7) 3(1.27,-4.7) 4(3.81,-4.7) 5(3.81,4.7) 6(1.27,4.7) 7(-1.27,4.7) 8(-3.81,4.7)
SOD-123_L2.7-W1.6-LS3.7-RD
  rect 0.91x1.22 smd: 1(-1.635,0) 2(1.635,0)
SON-8_L3.0-W3.0-P0.65-TL-EP
  rect 0.6x0.3 smd: 1(-1.4,0.976) 2(-1.4,0.325) 3(-1.4,-0.325) 4(-1.4,-0.976) 5(1.4,-0.976) 6(1.4,-0.325) 7(1.4,0.325) 8(1.4,0.976)
  rect 1.65x2.4 smd: 9(0,0)
SOP-8_L4.9-W3.9-P1.27-LS6.0-BL
  oval 0.63x1.865 smd: 1(-1.905,-2.683) 2(-0.635,-2.683) 3(0.635,-2.683) 4(1.905,-2.683) 5(1.905,2.683) 6(0.635,2.683) 7(-0.635,2.683) 8(-1.905,2.683)
SOT-9X3-3_L1.0-W0.8-P0.35-LS1.0-BR
  rect 0.3x0.2 smd: 1(0.5,-0.35) 2(0.5,0.35) 3(-0.5,0)
SOT-23-3_L2.9-W1.3-P1.90-LS2.4-BR
  rect 1.25x0.7 smd: 1(1,-0.95) 2(1,0.95) 3(-1,0)
SOT-666-6_L1.6-W1.2-P0.50-LS1.6-BR
  rect 0.85x0.3 smd: 1(0.725,-0.5) 2(0.725,0) 3(0.725,0.5) 4(-0.725,0.5) 5(-0.725,0) 6(-0.725,-0.5)
SW-SMD_4P-L5.1-W5.1-P3.70-LS6.5-TL_H1.5
  rect 1x0.75 smd: 1(-3,1.875) 2(3,1.875) 3(-3,-1.875) 4(3,-1.875)
TQFP-64_L10.0-W10.0-P0.50-LS12.0-BL-EP
  oval 0.28x1.6 smd: 1(-3.75,-5.7) 2(-3.25,-5.7) 3(-2.75,-5.7) 4(-2.25,-5.7) 5(-1.75,-5.7) 6(-1.25,-5.7) 7(-0.75,-5.7) 8(-0.25,-5.7) 9(0.25,-5.7) 10(0.75,-5.7) 11(1.25,-5.7) 12(1.75,-5.7) 13(2.25,-5.7) 14(2.75,-5.7) 15(3.25,-5.7) 16(3.75,-5.7) 33(3.75,5.7) 34(3.25,5.7) 35(2.75,5.7) 36(2.25,5.7) 37(1.75,5.7) 38(1.25,5.7) 39(0.75,5.7) 40(0.25,5.7) 41(-0.25,5.7) 42(-0.75,5.7) 43(-1.25,5.7) 44(-1.75,5.7) 45(-2.25,5.7) 46(-2.75,5.7) 47(-3.25,5.7) 48(-3.75,5.7)
  oval 1.6x0.28 smd: 17(5.7,-3.75) 18(5.7,-3.25) 19(5.7,-2.75) 20(5.7,-2.25) 21(5.7,-1.75) 22(5.7,-1.25) 23(5.7,-0.75) 24(5.7,-0.25) 25(5.7,0.25) 26(5.7,0.75) 27(5.7,1.25) 28(5.7,1.75) 29(5.7,2.25) 30(5.7,2.75) 31(5.7,3.25) 32(5.7,3.75) 49(-5.7,3.75) 50(-5.7,3.25) 51(-5.7,2.75) 52(-5.7,2.25) 53(-5.7,1.75) 54(-5.7,1.25) 55(-5.7,0.75) 56(-5.7,0.25) 57(-5.7,-0.25) 58(-5.7,-0.75) 59(-5.7,-1.25) 60(-5.7,-1.75) 61(-5.7,-2.25) 62(-5.7,-2.75) 63(-5.7,-3.25) 64(-5.7,-3.75)
  rect 4.04x4.04 smd: 65(0,0)
TSOT-23-6_L2.9-W1.6-P0.95-LS2.8-BL
  rect 0.55x1.2 smd: 1(-0.95,-1.2) 2(0,-1.2) 3(0.95,-1.2) 4(0.95,1.2) 5(0,1.2) 6(-0.95,1.2)
TSSOP-20_L6.5-W4.4-P0.65-LS6.4-BL
  oval 0.364x1.742 smd: 1(-2.925,-2.871) 2(-2.275,-2.871) 3(-1.625,-2.871) 4(-0.975,-2.871) 5(-0.325,-2.871) 6(0.325,-2.871) 7(0.975,-2.871) 8(1.625,-2.871) 9(2.275,-2.871) 10(2.925,-2.871) 11(2.925,2.871) 12(2.275,2.871) 13(1.625,2.871) 14(0.975,2.871) 15(0.325,2.871) 16(-0.325,2.871) 17(-0.975,2.871) 18(-1.625,2.871) 19(-2.275,2.871) 20(-2.925,2.871)
USB-A-TH__USB-AF-90
  round 1.5 hole 0.9: 1(-3.5,1.355) 2(-1,1.355) 3(1,1.355) 4(3.5,1.355)
  round 3.1 hole 2.1: SH1(7,-1.355) SH2(-7,-1.355)
USB-B-TH_XUNPU_USB-306BWD-ARW
  round 1.5 hole 0.9: 1(1.25,1.355) 2(-1.25,1.355) 3(-1.25,-0.645) 4(1.25,-0.645)
  round 1.2 hole 0.7: 5(-4.25,3.355) 6(-2.5,3.355) 7(0,3.355) 8(2.5,3.355) 9(4.25,3.355)
  round 3.4 hole 2.4: 10(6.02,-3.355) 11(-6.02,-3.355)
XF-508PVS-B-B-R
  rect 2x3 smd: 1(0,5) 2(0,0) 3(9.92,0) 4(9.906,4.953)

## Nets
As in the schematic.

Pads without a net: CN5 7 8; CN6 2 3; RN2 2 7; SW1 2 4; U1 5 8 9 13 14 15 18 19 20 21 22 27 35 36 40 41 42 43 44 45 49 50 53 54 55 56 57 63 73 74 75 76 77 78 79 87 88 89 90 91 92 96 97 99 100 102 110 111 112 113 117 125 126 127 128 129 132 133 134 135 139 140; U2 10 12 13 14 16 21; U6 11 12 13; U7 5 6 7 8 9 10 11 12 13 14 15 17 18 28 32 35 36 38 39 40 43 44 46 47 51 52 54 55 58 59 61 62; U12 9 10 11; U15 2 3 6 7; U25 10 12 13 14 16 21; U26 10 12 13 14 16 21; U27 10 12 13 14 16 21; U28 10 12 13 14 16 21; U29 10 12 13 14 16 21; U37 1 3 4 5; U38 1 3 4 5; U46 1; U47 1; U48 1; U49 1; U52 2 18; USB4 SH1 SH2; USB5 SH1 SH2; USB6 SH1 SH2; X1 2 4; X2 2 4

## Via types
v1: diameter 0.45, hole 0.3, Top Layer to Bottom Layer, 537 vias
v2: diameter 0.6, hole 0.45, Top Layer to Bottom Layer, 1 via

## Routing (per net, layer and track width the routed paths; a pad name or vN(x,y) marks a point on that pad's centre or on a via; arc(x,y) is an arc through that point)
1V1: length 62.7
  Top Layer w0.127: U7.53 69.44,41.14 C81.1 ; U7.45 76,35.02 C84.1 ; v1(64.44,36.96) 64.69,37.21 v1(65.94,37.21) v1(69.47,37.21) ; U7.60 65.94,40.76 C78.1 ; U7.37 76.13,31.02 C83.1 ; v1(72.14,35.05) v1(72.14,31.02) ; v1(64.64,28.45) 65.02,28.83 67.31,28.83 v1(67.69,28.45) ; U7.63 64.44,39.68 64.9,40.13 C79.1 ; 63.64,24.6 63.64,25.41 64.13,25.91 64.77,25.91 ; C80.1 64.77,25.91 ; 64.77,25.91 64.94,26.08 U7.19
  Top Layer w0.3: v1(58.55,23.62) 58.38,23.46 C71.1 58.38,21.55 C70.1 55.4,21.4 U15.1 ; v1(69.47,37.21) 69.47,38.44 U7.53 ; U7.37 v1(72.14,31.02) ; U7.25 67.94,28.2 v1(67.69,28.45) ; v1(64.64,28.45) 64.94,28.15 U7.19 ; v1(72.14,35.05) 72.17,35.02 U7.45 ; U7.60 v1(65.94,37.21) ; U7.63 v1(64.44,36.96)
  PWR w0.127: v1(72.14,31.02) 70.26,31.02 v1(67.69,28.45) ; v1(64.64,28.45) 59.82,23.62 v1(58.55,23.62) ; v1(72.14,35.05) 71.63,35.05 v1(69.47,37.21)
3V3: length 265.7
  Top Layer w0.127: U25.19 19.56,33.41 21.11,34.96 ; U1.32 v1(50.4,81.03) ; C106.1 v1(80.01,38.99) U37.2 ; U1.72 v1(42.52,60.08) 41.83,60.08 C98.2 ; U1.121 67.99,66.04 v1(70.03,66.04) C93.2 ; C75.1 59.68,36.02 U7.2 ; C33.1 19.56,52.08 19.56,50.97 ; U1.52 v1(42.76,70.08) 41.84,70.08 C97.2 ; C11.1 39.62,5.27 39.62,4.19 40,3.81 R11.2 ; C95.2 51.4,82.61 v1(51.4,81.87) U1.30 ; v1(80.77,68.83) 81.34,68.83 U39.8 U39.7 U39.6 U39.5 ; U1.17 57.91,79.65 v1(57.91,81.84) C94.2 ; U1.131 v1(70,71.08) 70.67,71.08 C100.2 ; R38.2 20.22,58.47 v1(20.22,58.14) ; v1(20.22,95.47) 20.22,95.8 R50.2 ; v1(80.9,54.23) 80.52,54.61 U38.2 80.01,52.52 C105.1 ; U1.144 v1(70.05,77.58) C87.2 ; C47.1 19.56,89.54 U28.19 ; C90.2 41.89,65.08 v1(42.49,65.08) U1.62 ; R67.2 v1(72.15,48.37) RN2.5 RN2.6 ; v1(20.22,39.34) 20.22,39.67 R32.2 ; C96.2 41.82,76.58 v1(44.35,76.58) U1.39 ; C99.2 v1(66.57,56.53) 65.9,57.2 U1.108 ; C89.2 63.4,82.61 v1(63.4,81.05) U1.6 ; v1(20.22,20.67) 20.22,21 R26.2 ; CN5.1 v1(60.58,46.35) ; v1(20.22,76.81) 20.22,77.13 R44.2 ; C54.1 19.56,108.21 19.56,107.1 ; C19.1 19.56,14.74 19.56,13.63 ; U7.48 75.72,36.52 C77.1 ; U1.84 53.9,54.44 C91.2 53.35,54.89 v1(53.34,54.89) ; C40.1 19.56,70.87 U27.19 ; C88.2 v1(69.49,77.09) 67.96,77.09 U1.143 ; v1(20.22,2) 20.22,2.33 R20.2 ; v1(70.94,28.32) 71.72,28.32 C76.1 ; U1.95 v1(59.4,55.03) 59.4,54.48 C92.2 ; R66.1 v1(50.16,86.49)
  Top Layer w0.3: v1(63.25,35.81) 63.04,36.02 U7.2 ; v1(65.53,28.32) 65.44,28.23 U7.20 ; R15.1 v1(50.11,22.23) 50.11,21.31 ; 50.11,21.31 C68.1 ; 50.11,21.31 50.18,21.38 v1(50.69,21.38) v1(51.64,21.38) U15.8 ; U7.31 v1(70.94,28.32) ; U7.48 72.2,36.52 v1(72.14,36.58)
  Top Layer w0.6: v1(37.34,3.81) 37.53,4 C10.1
  Top Layer w2: 38.48,8.13 38.28,8.33 L1.2
  PWR w0.127: v1(20.22,20.67) 22.99,20.67 24.14,21.83 v1(30.37,21.83) ; v1(30.37,96.63) 24.14,96.63 22.99,95.47 v1(20.22,95.47) ; v1(30.37,77.96) 24.14,77.96 22.99,76.81 v1(20.22,76.81) ; v1(30.37,3.16) 24.14,3.16 22.99,2 v1(20.22,2) ; v1(30.37,59.3) 24.14,59.3 22.99,58.14 v1(20.22,58.14) ; v1(30.37,40.5) 24.14,40.5 22.99,39.34 v1(20.22,39.34)
  PWR w0.6: v1(30.37,3.16) 36.69,3.16 v1(37.34,3.81)
  GND w0.127: v1(20.22,76.81) 20.22,89.2 v1(19.71,89.7) ; v1(20.22,58.14) 20.22,70.53 v1(19.71,71.03) ; v1(19.71,108.37) 20.22,107.87 v1(20.22,95.47) ; v1(19.71,14.9) 20.22,14.39 v1(20.22,2) ; v1(19.71,52.23) 20.22,51.73 v1(20.22,39.34) ; v1(20.22,20.67) 20.22,33.06 v1(19.71,33.57)
5V: length 53.8
  Top Layer w0.127: v1(67.82,98.42) 67.51,98.12 v1(67.51,93.12) U52.20 ; C5.1 71.25,42.35 v1(71.25,42.94) D6.5 ; U52.1 62.1,92.79 v1(62.1,92.84) ; C4.1 v1(77.84,33.29) 78.46,33.29 D1.5 ; R13.2 46.18,2.87 47.5,4.19 47.5,6.67 C13.1 ; C8.1 v1(77.85,29.36) 78.46,29.36 78.49,29.33
  Top Layer w0.4: C13.1 v1(45.91,7.49) v1(45.2,7.49) U13.4
  PWR w0.127: v1(67.51,93.12) 62.39,93.12 v1(62.1,92.84) ; v1(77.84,33.29) 77.85,33.28 v1(77.85,29.36) 80.29,26.92 86.36,26.92 ; 86.61,43.05 86.5,42.94 v1(71.25,42.94)
  vias: v1(70.92,118.16) v1(70.92,117.06) v1(70.92,115.96) v1(70.92,114.86) v1(70.92,113.76) v1(70.92,112.66) v1(70.92,111.56) v1(72.02,114.86) v1(72.02,113.76) v1(73.12,114.86) v1(73.12,113.76) v1(74.22,118.16) v1(74.22,117.06) v1(74.22,115.96) v1(74.22,114.86) v1(74.22,113.76) v1(74.22,112.66) v1(74.22,111.56)
12V: length 21.3
  Top Layer w1: CN2.3 75.35,131.63 D9.1 ; CN3.1 67.01,131.68 D10.1 ; CN2.1 82.35,131.59 D8.1 ; CN3.3 60.01,131.71 D11.1
  vias: v1(62.42,119.09) v1(62.42,117.99) v1(62.42,116.89) v1(62.42,115.79) v1(62.42,114.69) v1(62.42,113.59) v1(62.42,112.49) v1(62.42,111.39) v1(62.42,110.29) v1(63.52,119.09) v1(63.52,117.99) v1(63.52,116.89) v1(63.52,115.79) v1(63.52,114.69) v1(63.52,113.59) v1(63.52,112.49) v1(63.52,111.39) v1(63.52,110.29) v1(64.62,119.09) v1(64.62,114.69) v1(64.62,113.59) v1(65.72,119.09) v1(65.72,114.69) v1(65.72,113.59) v1(66.82,119.09) v1(66.82,114.69) v1(66.82,113.59)
12V_LIGHT1: length 6.1
  Top Layer w1: 95.84,75.91 95.83,75.92 Q1.3
12V_LIGHT2: length 6.4
  Top Layer w1: CN1.4 89.47,82.91 Q2.3
24V: length 66
  Top Layer w0.4: v1(14.88,43.78) 15.01,43.91 U26.3 ; C58.1 v1(17.34,22.45) C23.1 ; 15.01,50.97 15.01,52.04 v1(14.88,52.17) ; v1(14.88,25.24) 15.01,25.37 U25.3 ; C62.1 v1(17.34,97.25) C51.1 ; C17.1 16.37,17.5 v1(17.12,17.5) C15.1 ; v1(19.07,44.04) 18.91,44.21 U26.9 ; C38.1 16.37,73.63 v1(17.12,73.63) C36.1 ; v1(19.07,6.7) 18.91,6.87 18.91,7.9 ; C45.1 16.37,92.3 v1(17.12,92.3) C43.1 ; C67.1 v1(28.22,60.33) v1(28.22,61.36) C39.1 ; v1(14.88,6.45) 15.01,6.57 15.01,7.9 ; C52.1 v1(17.12,110.97) 16.37,110.97 16.34,110.94 ; C60.1 v1(17.34,41.12) C30.1 ; 15.01,107.1 15.01,108.18 v1(14.88,108.3) ; v1(14.88,89.63) 15.01,89.51 U28.26 ; v1(14.88,70.96) 15.01,70.84 U27.26 ; C37.1 v1(17.34,59.92) C66.1 ; v1(19.07,25.37) 18.91,25.54 U25.9 ; C32.1 v1(28.22,42.57) v1(28.22,41.54) C61.1 ; v1(14.88,81.25) 15.01,81.37 U28.3 ; U28.9 18.91,81.67 v1(19.07,81.5) ; C53.1 v1(28.22,98.71) v1(28.22,97.68) C63.1 ; v1(14.88,100.3) 15.01,100.42 U29.3 ; v1(14.88,14.83) 15.01,14.71 15.01,13.63 ; v1(14.88,33.5) 15.01,33.38 U25.26 ; C44.1 v1(17.34,78.58) C64.1 ; C24.1 16.37,36.17 v1(17.12,36.17) C22.1 ; v1(19.07,100.17) 18.91,100.34 U29.9 ; C29.1 v1(17.12,54.84) 16.37,54.84 C31.1 ; C16.1 v1(17.34,3.78) C56.1 ; C65.1 v1(28.22,78.97) v1(28.22,80) C46.1 ; C59.1 v1(28.22,22.96) v1(28.22,23.99) C25.1 ; v1(19.07,62.83) 18.91,63 U27.9 ; v1(14.88,62.59) 15.01,62.71 U27.3 ; C57.1 v1(28.22,4.41) v1(28.22,5.38) C18.1
GND: length 89.7
  Top Layer w0.127: RN2.8 72.71,51.62 v1(72.77,51.56) ; C70.2 v1(59.63,22.25) 59.63,22.83 C71.2 ; 46.67,6.09 46.67,5.52 v1(46.61,5.46) ; D1.2 79.37,33.26 79.25,33.15 v1(79.25,32.13) ; U1.83 53.4,56.7 v1(53.34,56.64) ; U1.120 v1(69.34,65.58) ; v1(44.96,66.04) 45.41,65.58 U1.61 ; U1.94 59.04,58.18 59.04,59.04 59.31,59.31 v1(59.31,59.56) ; v1(40.13,76.71) 40.26,76.58 C96.1 ; R3.1 v1(58.5,35.16) R2.1 R4.1 ; v1(55.5,27.18) 55.75,27.43 C3.2 57.16,28 R9.2 ; v1(74.68,23.5) 74.55,23.37 C1.2 ; C103.2 57.5,87.73 v1(57.28,87.5) ; v1(40.77,70.61) 40.77,70.14 C97.1 ; v1(69.22,70.61) 69.19,70.58 U1.130 ; C104.2 50.13,88.14 v1(49.66,88.14) ; v1(45.34,5.21) 45.04,5.5 U13.3 ; U38.8 77.72,64.26 v1(77.72,65.53) ; v1(69.34,55.88) 69,55.88 C99.1 ; C94.1 v1(57.91,84.45) ; C95.1 v1(51.82,83.73) ; C2.2 71.63,19.05 v1(71.88,18.8) ; v1(39.75,61.34) 40.32,61.34 C85.1 ; C89.1 v1(63.37,84.33) ; v1(46.35,51.05) 46.35,51.44 46.19,51.6 R75.1 ; 66.04,41.95 v1(64.26,41.95) 63.87,41.95 63.75,41.84 ; v1(52.96,26.03) 52.47,26.03 LED3.2 ; C8.2 76.12,29.34 v1(75.56,29.34) ; v1(48.51,20.45) 48.67,20.6 C68.2 ; CN5.9 v1(65.66,46.35) ; C93.1 v1(72.39,66.04) ; v1(75.06,26.54) 74.93,26.67 74.46,26.67 ; v1(50.93,38.23) 50.93,37.3 C108.1 ; C82.2 v1(64.17,23.46) C80.2 ; v1(72.39,76.07) 72.39,76.49 C88.1 C87.1 ; C84.2 v1(77.85,35.18) ; C4.2 76.12,33.27 v1(75.56,33.27) ; C109.1 51.05,45.27 v1(51.05,45.47) ; C90.1 40.22,65.66 v1(39.88,65.66) ; C81.2 v1(69.34,42.93) ; v1(76.96,31.62) 77.25,31.33 C83.2 ; CN5.5 v1(62.48,44.91) CN5.3 ; U1.51 46.25,70.48 45,70.48 v1(44.96,70.52) ; U1.38 v1(45.09,77.08) ; U37.8 78.23,49.28 v1(78.23,49.15) ; D6.2 71.38,44.91 71.38,44.53 71.51,44.4 71.89,44.4 71.96,44.32 v1(72.52,44.32) ; U52.10 62.74,86.61 v1(62.87,86.49) ; U1.107 65.54,58.18 65.54,59.04 65.91,59.41 v1(65.91,59.56) ; C92.1 v1(59.31,52.7) ; C91.1 53.63,53.09 v1(53.34,53.09) ; C106.2 v1(80.01,36.32) ; v1(44.07,83.19) 43.99,83.11 SW1.3 ; D14.3 v1(67.94,19.56) ; v1(35.31,6.1) 35.5,6.1 C10.2 ; D13.3 v1(66.42,19.56) ; C86.1 65.6,54.42 v1(66.04,53.97) ; R12.1 42.98,2.79 v1(42.54,2.79) ; v1(77.85,36.83) 77.72,36.96 C77.2 ; U15.4 55.46,23.33 v1(55.88,23.75) ; C5.2 v1(71.22,40.64) ; C100.1 v1(72.39,71.12) ; v1(52.96,34.16) 52.58,33.78 LED2.2 ; C105.2 v1(78.23,52.36) ; C98.1 v1(40,60.07) ; C9.2 v1(35.18,8.64) ; D5.3 v1(62.48,21.34) ; 79.94,29.33 79.8,29.47 79.43,29.47 79.3,29.6 79.3,30.3 v1(79.25,30.35) ; v1(51.31,29.72) 50.93,29.34 C107.1 ; U1.16 v1(58.4,81.03) ; U52.19 v1(66.42,91.81) ; R76.1 v1(46.23,54.14) ; LED1.2 v1(52.96,41.66)
  Top Layer w0.6: U15.9 53.97,23.37 v1(53.34,24) ; U15.9 53.97,21.59 v1(52.96,20.57) ; U15.9 54.48,22.86 v1(54.48,24) ; 33.79,2.46 RN1.1 34.16,1.73 v1(34.16,1.14) ; 33.79,2.46 v1(34.93,2.46) ; 33.79,2.46 RN1.2 RN1.3 33.79,4.06 ; 33.79,4.06 RN1.4 34.16,4.87 v1(34.16,5.59) ; 33.79,4.06 v1(34.93,4.06) ; v1(54.74,20.7) 53.97,21.46 53.97,20.83 v1(53.85,20.7)
  Bottom Layer w0.127: v1(44.96,66.04) v1(43.31,66.04)
GNDP: length 132.9
  Top Layer w0.127: R62.1 59.29,122.97 Q6.3 ; Q4.3 74.49,121.57 74.69,121.37 ; Q5.3 66.25,122.97 66.25,121.33 ; Q7.3 93.47,113.94 R64.1 ; R56.1 81.45,121.58 Q3.3
  Top Layer w0.4: U28.6 v1(16.96,81.63) ; v1(28.22,11.53) C18.2 27.11,14.03 v1(27.07,14.07) ; R30.2 23.93,54.76 v1(24.27,55.1) ; C61.2 28.16,39.59 v1(27.58,39.59) ; C57.2 28.16,2.26 v1(27.58,2.26) ; v1(28.22,86.33) C46.2 27.11,88.83 v1(27.07,88.87) ; R18.2 23.95,17.42 v1(24.15,17.62) ; v1(12.98,4.16) 12.81,4.33 11.24,4.33 ; v1(12.98,60.3) 12.81,60.46 R35.1 ; 17.61,13.63 17.61,14.63 v1(17.68,14.7) ; C66.2 v1(17.49,58.52) C37.2 ; v1(12.98,41.5) 12.81,41.66 R29.1 ; C31.2 v1(17.12,56.21) 17.94,56.21 C29.2 ; 17.61,50.97 17.61,51.97 v1(17.68,52.04) ; v1(27.58,58.39) 28.16,58.39 C67.2 ; R24.2 23.93,36.09 v1(24.27,36.44) ; 17.97,37.57 17.94,37.54 v1(17.12,37.54) C24.2 ; C23.2 v1(17.49,21.05) C58.2 ; C34.2 25.11,39.66 v1(25.17,39.59) ; C52.2 17.94,112.34 v1(17.12,112.34) 16.34,112.34 ; R51.2 v1(20.35,110.89) 20.84,110.89 C54.2 ; R47.1 12.81,97.8 v1(12.98,97.63) ; C27.2 25.11,20.99 v1(25.17,20.93) ; v1(24.13,73.79) 23.9,73.56 R36.2 ; R21.2 v1(20.35,17.42) 20.84,17.42 C19.2 ; C16.2 v1(17.49,2.38) C56.2 ; v1(17.68,108.17) 17.61,108.1 17.61,107.1 ; R28.2 v1(13.1,54.58) ; R41.1 12.81,79.13 v1(12.98,78.96) ; v1(17.68,89.5) 17.61,89.43 U28.22 ; C59.2 28.16,20.93 v1(27.58,20.93) ; v1(28.22,105) C53.2 27.11,107.5 v1(27.07,107.54) ; C65.2 28.16,77.06 v1(27.58,77.06) ; v1(17.68,70.84) 17.61,70.77 U27.22 ; R34.2 v1(13.1,73.38) ; C20.2 25.11,2.32 v1(25.17,2.26) ; C51.2 v1(17.49,95.85) C62.2 ; v1(12.98,22.83) 12.81,23 R23.1 ; R16.2 v1(13.1,17.24) ; C55.2 25.11,95.79 v1(25.17,95.73) ; C64.2 v1(17.49,77.18) C44.2 ; v1(27.07,51.41) 27.11,51.37 C32.2 v1(28.22,48.87) ; v1(17.68,33.37) 17.61,33.3 U25.22 ; U27.6 v1(16.96,62.96) ; U26.6 v1(16.96,44.17) ; R45.2 v1(20.35,92.22) 20.84,92.22 C47.2 ; v1(27.07,32.74) 27.11,32.7 C25.2 v1(28.22,30.2) ; C45.2 v1(17.12,93.67) 17.94,93.67 17.97,93.7 ; R39.2 v1(20.35,73.56) 20.84,73.56 C40.2 ; C26.2 20.84,36.09 v1(20.35,36.09) R27.2 ; U29.6 v1(16.96,100.3) ; v1(28.22,67.66) C39.2 27.11,70.17 v1(27.07,70.2) ; v1(24.13,92.58) 23.77,92.22 R42.2 ; C63.2 28.16,95.73 v1(27.58,95.73) ; R46.2 v1(13.1,110.71) ; C15.2 17.94,18.87 v1(17.12,18.87) C17.2 ; C48.2 25.11,77.12 v1(25.17,77.06) ; R22.2 v1(13.1,35.91) ; C38.2 v1(17.12,75.01) 17.94,75.01 C36.2 ; C30.2 v1(17.49,39.72) C60.2 ; C33.2 20.84,54.76 v1(20.35,54.76) R33.2 ; U25.6 v1(16.96,25.5) ; v1(25.17,58.39) 25.11,58.45 C41.2 ; 16.96,7.9 v1(16.96,6.83) ; R40.2 v1(13.1,92.05) ; R48.2 24.03,110.89 v1(24.26,111.12)
  Top Layer w0.5: U2.29 17.61,11.09 17.61,13.63
  Top Layer w0.6: R54.1 86.93,82.48 Q2.2 87.5,81.91 v1(87.5,81.03) ; Q6.1 v1(57.19,123.17) Q6.2 v1(58.45,123.17) Q6.3 ; R52.1 87.26,75.46 Q1.2 v1(87.75,74.17) ; Q7.1 v1(91.35,114.14) Q7.2 v1(92.54,114.14) Q7.3 ; Q4.1 v1(72.59,123.21) Q4.2 v1(73.88,123.21) Q4.3 ; Q3.3 v1(80.79,123.21) Q3.2 v1(79.5,123.21) Q3.1 ; Q5.3 v1(65.45,123.17) Q5.2 v1(64.16,123.17) Q5.1 ; v1(30.99,1.91) 31.8,1.91 RN1.8 ; v1(32,5.33) 32,4.51 RN1.5 31.94,4.44 v1(30.99,4.44)
  Top Layer w1: RN1.5 RN1.6 RN1.7 RN1.8
  vias: v1(57.24,125.35) v1(57.16,124.41) v1(58.34,125.35) v1(58.26,124.41) v1(63.97,124.59) v1(64.22,125.48) v1(65.07,124.59) v1(65.32,125.48) v1(72.4,124.62) v1(72.65,125.51) v1(73.5,124.62) v1(73.75,125.51) v1(79.36,124.63) v1(79.62,125.52) v1(80.46,124.63) v1(80.72,125.52) v1(86.76,80.98) v1(87.05,74) v1(88.73,115.46) v1(88.73,114.46) v1(88.73,113.46) v1(88.73,112.46) v1(88.73,111.46) v1(89.73,115.46) v1(89.73,114.46) v1(89.73,113.46) v1(89.73,112.46) v1(89.73,111.46) v1(90.73,115.46) v1(90.73,112.46) v1(90.73,111.46) v1(91.73,115.46) v1(91.73,112.46) v1(91.73,111.46) v1(92.73,115.46) v1(92.73,113.46) v1(92.73,112.46) v1(92.73,111.46)
VBUS: length 63.9
  Top Layer w0.127: U1.101 62.4,54.57 67.18,49.78 67.18,40.13 v1(66.93,39.88) ; C3.1 55.94,29.21 v1(56.5,29.21) R10.1
  Bottom Layer w0.127: USB7.1 66.61,14.73 59.06,14.73 56.5,17.28 v1(56.5,29.21) 60.83,29.21 66.93,35.31 v1(66.93,39.88)
_LED1_OUT: length 20.8
  Top Layer w0.127: U52.11 71.89,86.61 82.04,76.45 R53.2
_LED2_OUT: length 17.9
  Top Layer w0.127: U52.12 71.56,87.26 75.38,83.44 83.84,83.44
_PUMP: length 43.5
  Top Layer w0.127: U52.13 71.78,87.91 82.04,98.17 90.17,98.17 95.63,103.63 R65.2
_SOL1_BLOW: length 53.4
  Top Layer w0.127: U52.15 72.43,89.21 81.85,98.63 84.72,98.63 86.26,100.17 86.26,120.05 85.91,120.4 77.47,120.4 76.91,120.95 R59.2
_SOL1_VAC: length 46.9
  Top Layer w0.127: U52.14 72.11,88.56 81.95,98.4 84.81,98.4 86.49,100.08 86.49,120.14 85.2,121.43 R57.2
_SOL2_BLOW: length 39
  Top Layer w0.127: U52.17 68.56,90.51 68.99,90.93 68.99,119.99 68.58,120.4 62.1,120.4 61.48,121.02 61.48,121.42
_SOL2_VAC: length 33.4
  Top Layer w0.127: R61.2 69.22,120.57 69.22,90.04 68.96,89.79 67.59,89.79 U52.16
BOOT0: length 37.7
  Top Layer w0.127: v1(54.36,64.52) 54.48,64.4 v1(54.48,63.12) ; v1(61.59,67.31) 59.82,65.53 v1(55.12,65.53) ; U1.138 66.71,74.58 64.77,72.64 v1(64.77,70.48) ; v1(50.16,61.98) 48.25,60.06 48.25,59.25 44.74,55.74 R76.2 H3.2
  Bottom Layer w0.127: v1(50.16,61.98) 53.34,61.98 v1(54.48,63.12) ; v1(55.12,65.53) 55.12,65.29 v1(54.36,64.52) ; v1(61.59,67.31) v1(64.77,70.48)
BOOT1: length 39.5
  Top Layer w0.127: v1(46.61,52.07) 45.99,52.07 45.98,52.08 45.23,52.08 R75.2 H3.4 ; U1.48 46.3,72.14 v1(44.83,72.14) ; v1(38.48,72.64) 36.32,70.48 v1(36.32,59.94)
  Bottom Layer w0.127: v1(46.61,52.07) 38.74,59.94 v1(36.32,59.94) ; v1(44.83,72.14) 44.32,72.64 v1(38.48,72.64)
D1+: length 21.3
  Top Layer w0.127: U7.56 67.94,39.39 67.83,39.5 67.83,50.17 63.79,54.21 63.79,56.8 63.9,56.91 U1.104
D1-: length 21.3
  Top Layer w0.127: U1.103 63.4,56.91 63.51,56.8 63.51,54.09 67.55,50.05 67.55,39.5 67.44,39.39 U7.57
D2+: length 5.3
  Top Layer w0.127: U7.33 74.05,29.02 74.23,29.2 75.08,29.2 75.44,28.84 D7.6
D2-: length 5.3
  Top Layer w0.127: U7.34 73.43,29.47 75.08,29.47 75.45,29.85 78.48,29.85 D7.4
D3+: length 5.3
  Top Layer w0.127: D1.6 75.45,32.76 75.09,33.12 74.56,33.12 74.56,33.13 74.43,33.13 74.32,33.02 U7.41
D3-: length 5.3
  Top Layer w0.127: U7.42 74.32,33.52 74.43,33.41 74.67,33.41 74.67,33.4 75.07,33.4 75.44,33.78 78.48,33.78 D1.4
D4+: length 5.3
  Top Layer w0.127: D6.6 71.75,43.04 71.71,43 71.71,40.5 71.39,40.18 71.39,38.64 71.44,38.58 U7.49
D4-: length 5.2
  Top Layer w0.127: U7.50 70.94,40.3 70.78,40.46 70.78,40.71 70.74,40.75 70.74,43.03 70.75,43.04 D6.4
DCAM1+: length 24.5
  Top Layer w0.127: v1(71.55,46.9) 71.39,46.74 71.39,45.78 71.75,45.42 D6.1
  Bottom Layer w0.127: 92.12,46.47 91.24,46.47 90.38,45.61 75.01,45.61 arc(74.97,45.62) 74.95,45.66 arc(74.94,45.7) 74.9,45.72 74.71,45.72 arc(74.67,45.7) 74.65,45.66 arc(74.64,45.62) 74.6,45.61 74.41,45.61 arc(74.37,45.62) 74.35,45.66 arc(74.34,45.7) 74.3,45.72 74.11,45.72 arc(74.07,45.7) 74.05,45.66 arc(74.04,45.62) 74,45.61 73.81,45.61 arc(73.77,45.62) 73.75,45.66 arc(73.74,45.7) 73.7,45.72 73.51,45.72 arc(73.47,45.7) 73.45,45.66 arc(73.44,45.62) 73.4,45.61 73.21,45.61 arc(73.17,45.62) 73.15,45.66 arc(73.14,45.7) 73.1,45.72 72.91,45.72 arc(72.87,45.7) 72.85,45.66 arc(72.84,45.62) 72.8,45.61 72.39,45.61 71.39,46.61 71.39,46.74 v1(71.55,46.9)
DCAM1-: length 24.4
  Top Layer w0.127: D6.3 70.75,45.42 71.11,45.78 71.11,46.74 v1(70.95,46.9)
  Bottom Layer w0.127: 92.12,44.47 91.24,44.47 90.38,45.33 72.28,45.33 71.11,46.49 71.11,46.74 v1(70.95,46.9)
DCAM2+: length 17.2
  Top Layer w0.127: D1.1 80.32,32.76 80.68,33.12 84.21,33.12 87.86,29.48 87.86,27.31 v1(87.7,27.14)
  Bottom Layer w0.127: v1(87.7,27.14) 87.86,27.31 87.86,27.55 88.26,27.95 90.38,27.95 91.24,28.81 92.12,28.81
DCAM2-: length 17.2
  Top Layer w0.127: D1.3 80.32,33.76 80.68,33.4 84.33,33.4 88.14,29.59 88.14,27.31 v1(88.3,27.14)
  Bottom Layer w0.127: 92.12,26.81 91.24,26.81 90.38,27.67 88.38,27.67 88.14,27.43 88.14,27.31 v1(88.3,27.14)
DIAG1: length 90.4
  Top Layer w0.127: 22.16,13.63 24.65,16.13 v1(26.29,16.13) ; v1(57.02,62.61) 56.26,61.85 v1(54.61,61.85) ; R71.2 50.58,26.9 LED3.1 51.26,25.15 v1(51.94,25.15) ; v1(48.77,61.59) 48.28,62.08 U1.68
  Bottom Layer w0.127: 51.32,25.15 56.72,30.54 56.72,62.05 57.02,62.36 v1(57.02,62.61) ; 51.32,25.15 v1(51.94,25.15) ; 51.32,25.15 47.31,21.13 33.72,21.13 28.71,16.13 v1(26.29,16.13) ; v1(54.61,61.85) 54.14,61.38 53.54,61.38 53.4,61.53 50.31,61.53 50.16,61.38 48.98,61.38 v1(48.77,61.59)
DIAG2: length 92.7
  Top Layer w0.127: U25.15 22.16,32.32 v1(22.73,32.89) ; v1(54.86,32.64) 51.15,32.64 LED2.1 50.6,34.38 R72.2 ; U1.65 v1(48.01,63.58)
  Bottom Layer w0.127: 55.12,32.64 55.12,63.37 54.91,63.58 v1(48.01,63.58) ; 55.12,32.64 55.12,31.21 46.64,22.74 30.99,22.74 25.91,27.81 25.91,32.51 25.27,33.15 22.99,33.15 v1(22.73,32.89) ; 55.12,32.64 v1(54.86,32.64)
DIAG4: length 73
  Top Layer w0.127: v1(38.61,68.96) 38.61,64.14 38.35,63.88 v1(38.35,62.23) ; v1(58.42,56.77) 58.42,58.01 U1.93 58.26,58.18 58.26,59.04 56.97,60.33 53.73,60.33 53.61,60.45 v1(52.45,60.45) ; v1(57.28,43.31) 57.05,43.53 R73.2 50.63,42.28 LED1.1 ; v1(22.86,70.61) 22.16,69.91 U27.15
  Bottom Layer w0.127: v1(57.28,43.31) 56.95,43.64 56.95,56.44 57.28,56.77 v1(58.42,56.77) ; v1(38.35,62.23) 38.35,62.36 38.62,62.63 42.04,62.63 42.05,62.61 44.38,62.61 45.84,61.15 51.75,61.15 v1(52.45,60.45) ; v1(22.86,70.61) 23.65,71.4 36.61,71.4 38.61,69.4 v1(38.61,68.96)
DIR1: length 98.1
  Top Layer w0.127: v1(17.04,15.21) 16.96,15.12 16.96,13.63 ; v1(60.96,78.23) 60.9,78.29 U1.11
  Bottom Layer w0.127: v1(60.96,78.23) 60.96,75.56 56.26,70.87 56.26,30.73 47.12,21.59 33.53,21.59 28.83,16.89 18.72,16.89 v1(17.04,15.21)
DIR2: length 93.2
  Top Layer w0.127: v1(50.04,67.44) 49.19,66.58 U1.59 ; U25.23 16.96,34.1 v1(17.27,34.42)
  PWR w0.127: v1(53.91,60.77) 53.65,61.03 53.65,61.27 53.4,61.53 53.15,61.53 51.69,62.99 51.69,66.04 50.29,67.44 v1(50.04,67.44)
  Bottom Layer w0.127: v1(53.91,60.77) 54.66,60.02 54.66,33.66 54.19,33.19 54.19,32.36 54.63,31.92 54.63,31.38 46.45,23.19 33.19,23.19 32.77,23.62 32.75,23.62 32.69,23.68 32.33,23.68 32.27,23.62 30.42,23.62 26.14,27.91 26.14,32.66 24.38,34.42 v1(17.27,34.42)
DIR3: length 56.9
  Top Layer w0.127: v1(52.45,78.23) 52.45,79.58 U1.28 ; v1(18.8,53.34) 18.67,53.21 18.23,53.21 17.22,52.2 17.22,51.23 16.96,50.97
  PWR w0.127: v1(48.9,62.61) 48.9,74.68 v1(52.45,78.23)
  Bottom Layer w0.127: v1(48.9,62.61) 48.36,63.14 47.82,63.14 47.44,63.52 44.78,63.52 44.56,63.31 38.1,63.31 27.72,52.93 19.32,52.93 18.91,53.34 v1(18.8,53.34)
DIR4: length 52.9
  Top Layer w0.127: v1(49.53,78.23) 49.4,78.36 U1.34 ; U27.23 17.22,70.03 17.22,71 18.05,71.83 18.24,71.83 v1(18.42,72.01)
  GND w0.127: v1(49.53,78.23) 50.8,76.96 v1(50.8,65.41)
  Bottom Layer w0.127: v1(18.42,72.01) 18.47,72.07 19.47,72.07 19.69,71.86 36.85,71.86 43.31,65.41 v1(50.8,65.41)
DIR5: length 48.4
  Top Layer w0.127: v1(16.89,89.53) 16.96,89.47 U28.23 ; U1.58 41.88,67.08 39.24,69.72 v1(39.24,76.07)
  PWR w0.127: v1(16.89,89.53) 16.89,88.77 18.16,87.5 19.69,87.5 22.1,85.09 v1(22.1,81.03)
  Bottom Layer w0.127: v1(22.1,81.03) 22.1,78.05 24.35,75.79 38.61,75.79 38.89,76.07 v1(39.24,76.07)
DIR6: length 99.4
  Top Layer w0.127: v1(17.4,109.09) 16.96,108.65 16.96,107.1 ; v1(69.72,66.8) 68.94,67.58 U1.124
  Bottom Layer w0.127: v1(69.72,66.8) 69.09,66.8 67.82,68.07 67.82,75.56 61.98,81.41 60.96,81.41 60.83,81.28 60.83,79.76 59.98,78.9 37.77,78.9 36.18,77.32 28.99,77.32 28.1,78.21 26.92,78.21 26.62,78.51 26.62,106.8 24.38,109.04 22.35,109.04 22.3,109.09 v1(17.4,109.09)
DSUB+: length 31.6
  Top Layer w0.127: v1(88.59,8.73) 88.75,8.89 88.75,14.11 86.04,16.82 86.04,27.49 84.33,29.2 80.68,29.2 80.32,28.84 D7.1
  Bottom Layer w0.127: v1(88.59,8.73) 88.75,8.89 88.75,9.13 90.04,10.43 90.38,10.43 91.24,11.29 92.12,11.29
DSUB-: length 31.6
  Top Layer w0.127: v1(89.19,8.73) 89.03,8.89 89.03,14.22 86.31,16.94 86.31,27.6 84.44,29.47 80.68,29.47 80.32,29.84 D7.3
  Bottom Layer w0.127: v1(89.19,8.73) 89.03,8.89 89.03,9.02 90.16,10.15 90.38,10.15 91.24,9.29 92.12,9.29
EN1: length 113.1
  Top Layer w0.127: R20.1 17.47,5.94 v1(16.66,5.94) 16.31,6.29 16.31,7.9 ; v1(60.32,78.23) 60.4,78.31 U1.12
  GND w0.127: v1(16.66,5.94) 15.62,6.98 15.62,11.94 16.13,12.45 17.53,12.45 18.16,13.08 18.16,14.86 19.05,15.75 24.13,15.75 v1(25.91,17.53)
  Bottom Layer w0.127: v1(25.91,17.53) 26.29,17.15 28.76,17.15 33.43,21.82 47.02,21.82 56.03,30.83 56.03,71.02 60.32,75.31 v1(60.32,78.23)
EN2: length 93.9
  Top Layer w0.127: v1(66.55,67.06) 67.92,67.06 U1.123 ; U25.5 16.31,24.59 16.91,23.99 18.09,23.99 R26.1 19.81,21.97 v1(19.18,21.97) ; v1(32.51,23.24) 31.88,22.61 v1(31.88,22.07) ; v1(57.28,61.72) 56.51,60.96 v1(54.61,60.96)
  GND w0.127: v1(57.28,61.72) 62.61,67.06 v1(66.55,67.06)
  Bottom Layer w0.127: v1(31.88,22.07) 31.67,22.28 19.48,22.28 v1(19.18,21.97) ; v1(54.61,60.96) 54.89,60.68 54.89,33.17 54.86,33.15 54.75,33.15 54.42,32.82 54.42,32.46 54.86,32.02 54.86,31.28 46.55,22.96 32.79,22.96 v1(32.51,23.24)
EN3: length 76.4
  Top Layer w0.127: v1(53.21,78.23) 53.4,78.42 U1.26 ; 16.31,43.13 17.16,42.28 18.47,42.28 R32.1 ; 16.31,43.13 U26.5 ; 16.31,43.13 16.31,42.72 v1(16.13,42.54)
  PWR w0.127: v1(53.21,78.23) 49.4,74.42 v1(49.4,62.1)
  GND w0.127: v1(16.13,42.54) 16.13,46.23 15.24,47.12 15.24,51.05 18.03,53.85 21.08,53.85 v1(22.86,52.07)
  Bottom Layer w0.127: v1(49.4,62.1) 45.21,62.1 44.46,62.86 38.29,62.86 27.88,52.45 22.99,52.45 22.86,52.32 v1(22.86,52.07)
EN4: length 54.4
  Top Layer w0.127: v1(20.83,60.58) 20.32,60.07 20.32,59.94 19.96,59.58 18.08,61.47 17.27,61.47 16.31,62.43 U27.5 ; v1(49.66,76.83) 50.29,76.83 51.9,78.44 U1.29
  PWR w0.127: v1(49.66,76.83) 49.66,75.76 48.3,74.41 48.3,70.01 44.52,66.22 44.52,65.85 v1(43.05,64.39)
  Bottom Layer w0.127: v1(20.83,60.58) 24.94,56.46 30.28,56.46 37.82,64.01 42.93,64.01 43.05,64.14 v1(43.05,64.39)
EN5: length 38.7
  Top Layer w0.127: U28.5 16.31,80.72 17.53,79.5 18.67,79.5 19.92,78.25 R44.1 20.58,78.87 v1(20.95,78.87) ; U1.37 46.36,77.6 v1(47.62,77.6)
  Bottom Layer w0.127: v1(47.62,77.6) 47.62,76.45 46.74,75.56 24.26,75.56 v1(20.95,78.87)
EN6: length 71.4
  Top Layer w0.127: U1.10 61.4,80.84 v1(61.34,80.9) ; U29.5 16.31,99.65 17.78,98.17 19.05,98.17 19.96,97.26 R50.1 19.43,96.39 v1(19.43,94.74)
  Bottom Layer w0.127: v1(19.43,94.74) 24.38,94.74 26.16,92.96 26.16,77.98 26.42,77.72 27.94,77.72 28.88,76.78 38,76.78 39.78,78.56 49.24,78.56 49.35,78.67 60.51,78.67 60.62,78.56 60.66,78.56 61.47,79.38 61.47,80.77 v1(61.34,80.9)
IN_D+: length 25
  Top Layer w0.2: USB7.3 64.22,11.67 63.38,12.51 61.7,12.51 58.85,15.36 58.85,18.68 60.65,20.47 60.65,21.17 60.99,21.5 61.32,21.5 61.51,21.69 D5.1 62.16,21.69 62.29,21.81 62.99,21.81 63.3,21.5 64.68,21.5 65.91,22.73 65.91,25.66 66.03,25.78 66.03,25.98 65.94,26.07 U7.21
IN_D-: length 25
  Top Layer w0.2: USB7.2 64.22,13.67 63.38,12.84 61.84,12.84 59.18,15.49 59.18,15.94 arc(59.22,16.03) 59.31,16.07 arc(59.4,16.11) 59.44,16.2 59.44,16.24 arc(59.4,16.33) 59.31,16.37 arc(59.22,16.41) 59.18,16.5 59.18,16.54 arc(59.22,16.63) 59.31,16.67 arc(59.4,16.71) 59.44,16.8 59.44,16.84 arc(59.4,16.93) 59.31,16.97 arc(59.22,17.01) 59.18,17.1 59.18,18.54 60.98,20.34 60.98,21.03 61.12,21.17 61.32,21.17 61.51,20.99 D5.2 62.16,20.99 62.29,20.86 62.99,20.86 63.3,21.17 64.81,21.17 66.24,22.6 66.24,25.53 66.35,25.64 66.35,25.98 66.44,26.07 U7.22
LED1_OUT: length 32
  Top Layer w0.127: U52.9 60.59,87.26 60.45,87.12 60.45,82.04 v1(60.32,81.92) ; v1(60.96,59.56) 60.96,58.09 U1.98 ; v1(59.94,73.53) 59.06,74.42 v1(59.06,76.58)
  PWR w0.127: v1(60.32,81.92) 60.31,81.9 60.31,78.84 59.88,78.41 59.88,78.23 59.37,77.71 59.37,76.71 59.24,76.58 v1(59.06,76.58)
  Bottom Layer w0.127: v1(60.96,59.56) 60.96,72.52 v1(59.94,73.53)
LED2_OUT: length 10.3
  Top Layer w0.127: U52.8 61.8,87.88 63.37,87.88 64.4,86.86 U1.4
MCU_RST: length 69
  Top Layer w0.127: U1.25 v1(53.9,81.15) ; SW1.1 40.34,83.11 v1(40.51,82.93) ; v1(62.99,53.34) 65.66,50.67 CN5.10 v1(66.42,48.81) ; R67.1 70.35,48.6 RN2.4 70.42,49.15 v1(70.99,49.15)
  GND w0.127: v1(62.99,53.34) 60.58,55.75 52.32,55.75 51.05,57.02 51.05,65.04 51.24,65.22 51.24,65.59 51.05,65.77 51.05,78.31 v1(53.9,81.15)
  Bottom Layer w0.127: v1(66.42,48.81) 66.76,49.15 v1(70.99,49.15) ; v1(40.51,82.93) 42.29,81.15 49.9,81.15 50.22,81.47 50.58,81.47 50.9,81.15 v1(53.9,81.15)
